# EAGLE schematic electrosteel2020_10_arrange4 (EAGLE 9.2.2), part 1 of 2
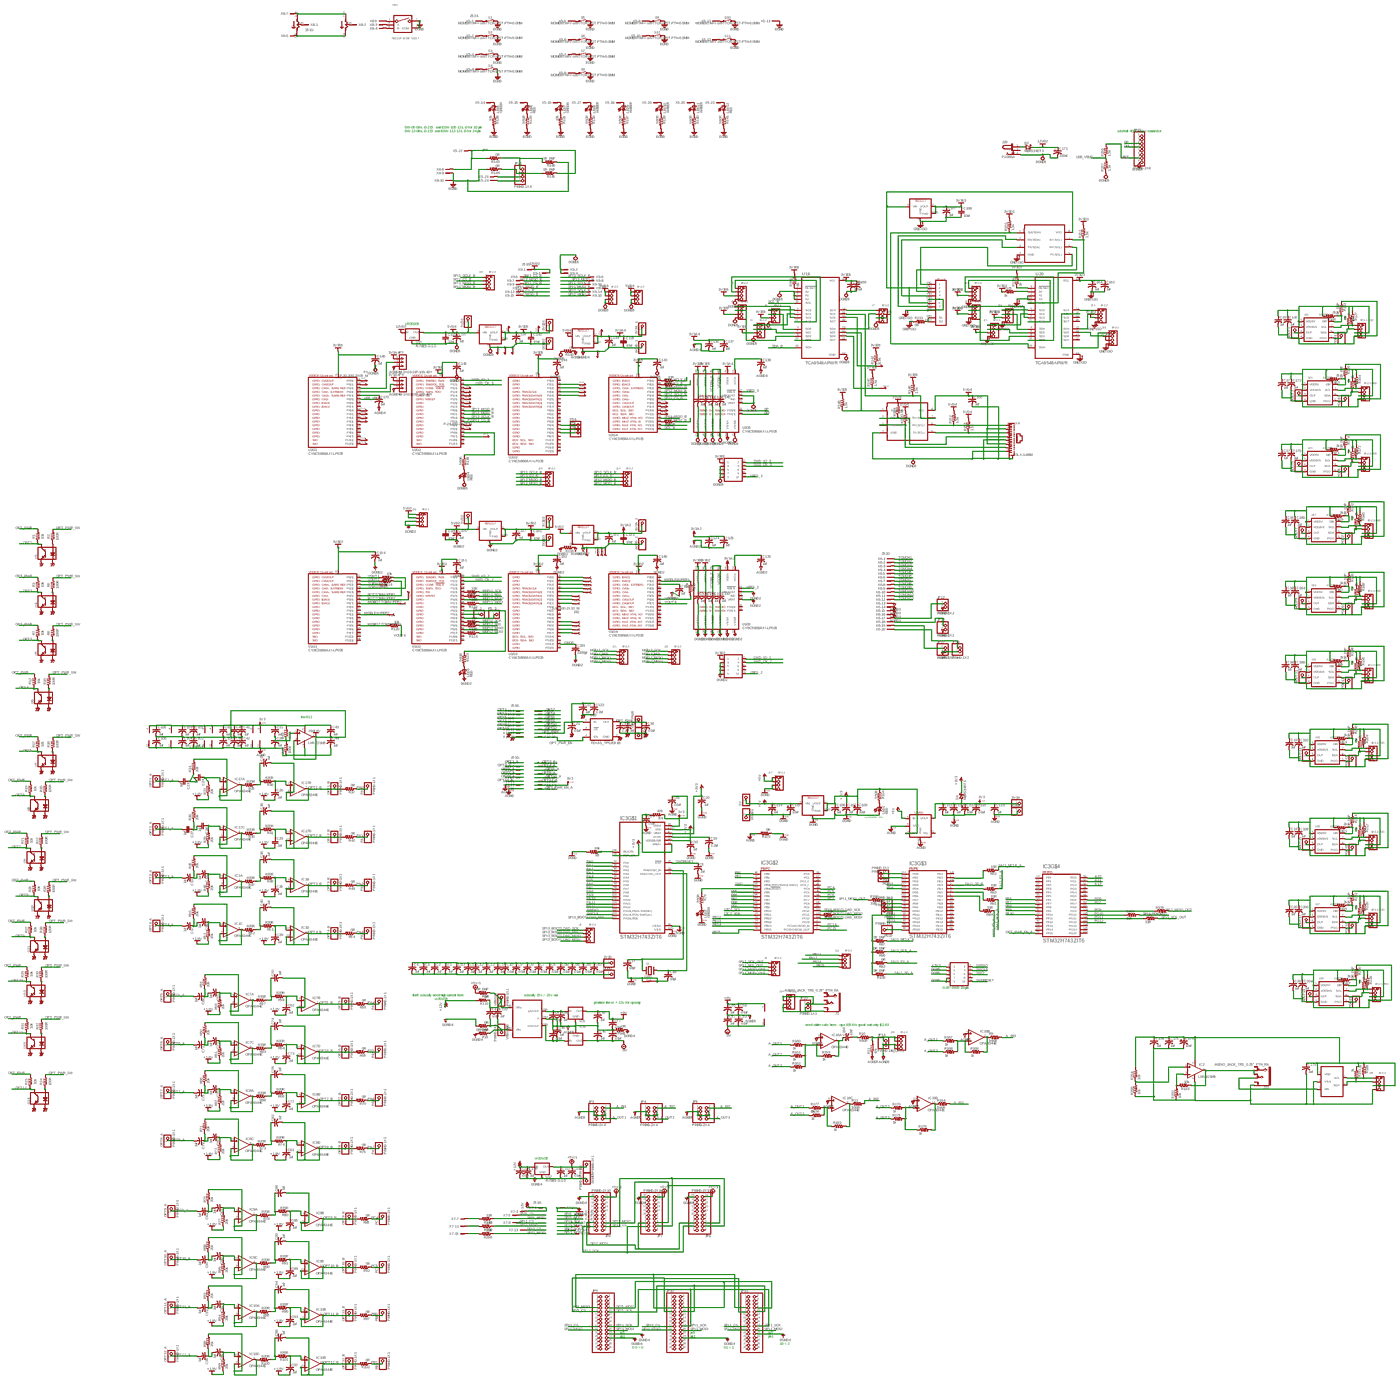
[diagram p0: schematic, sheet 1, overview]
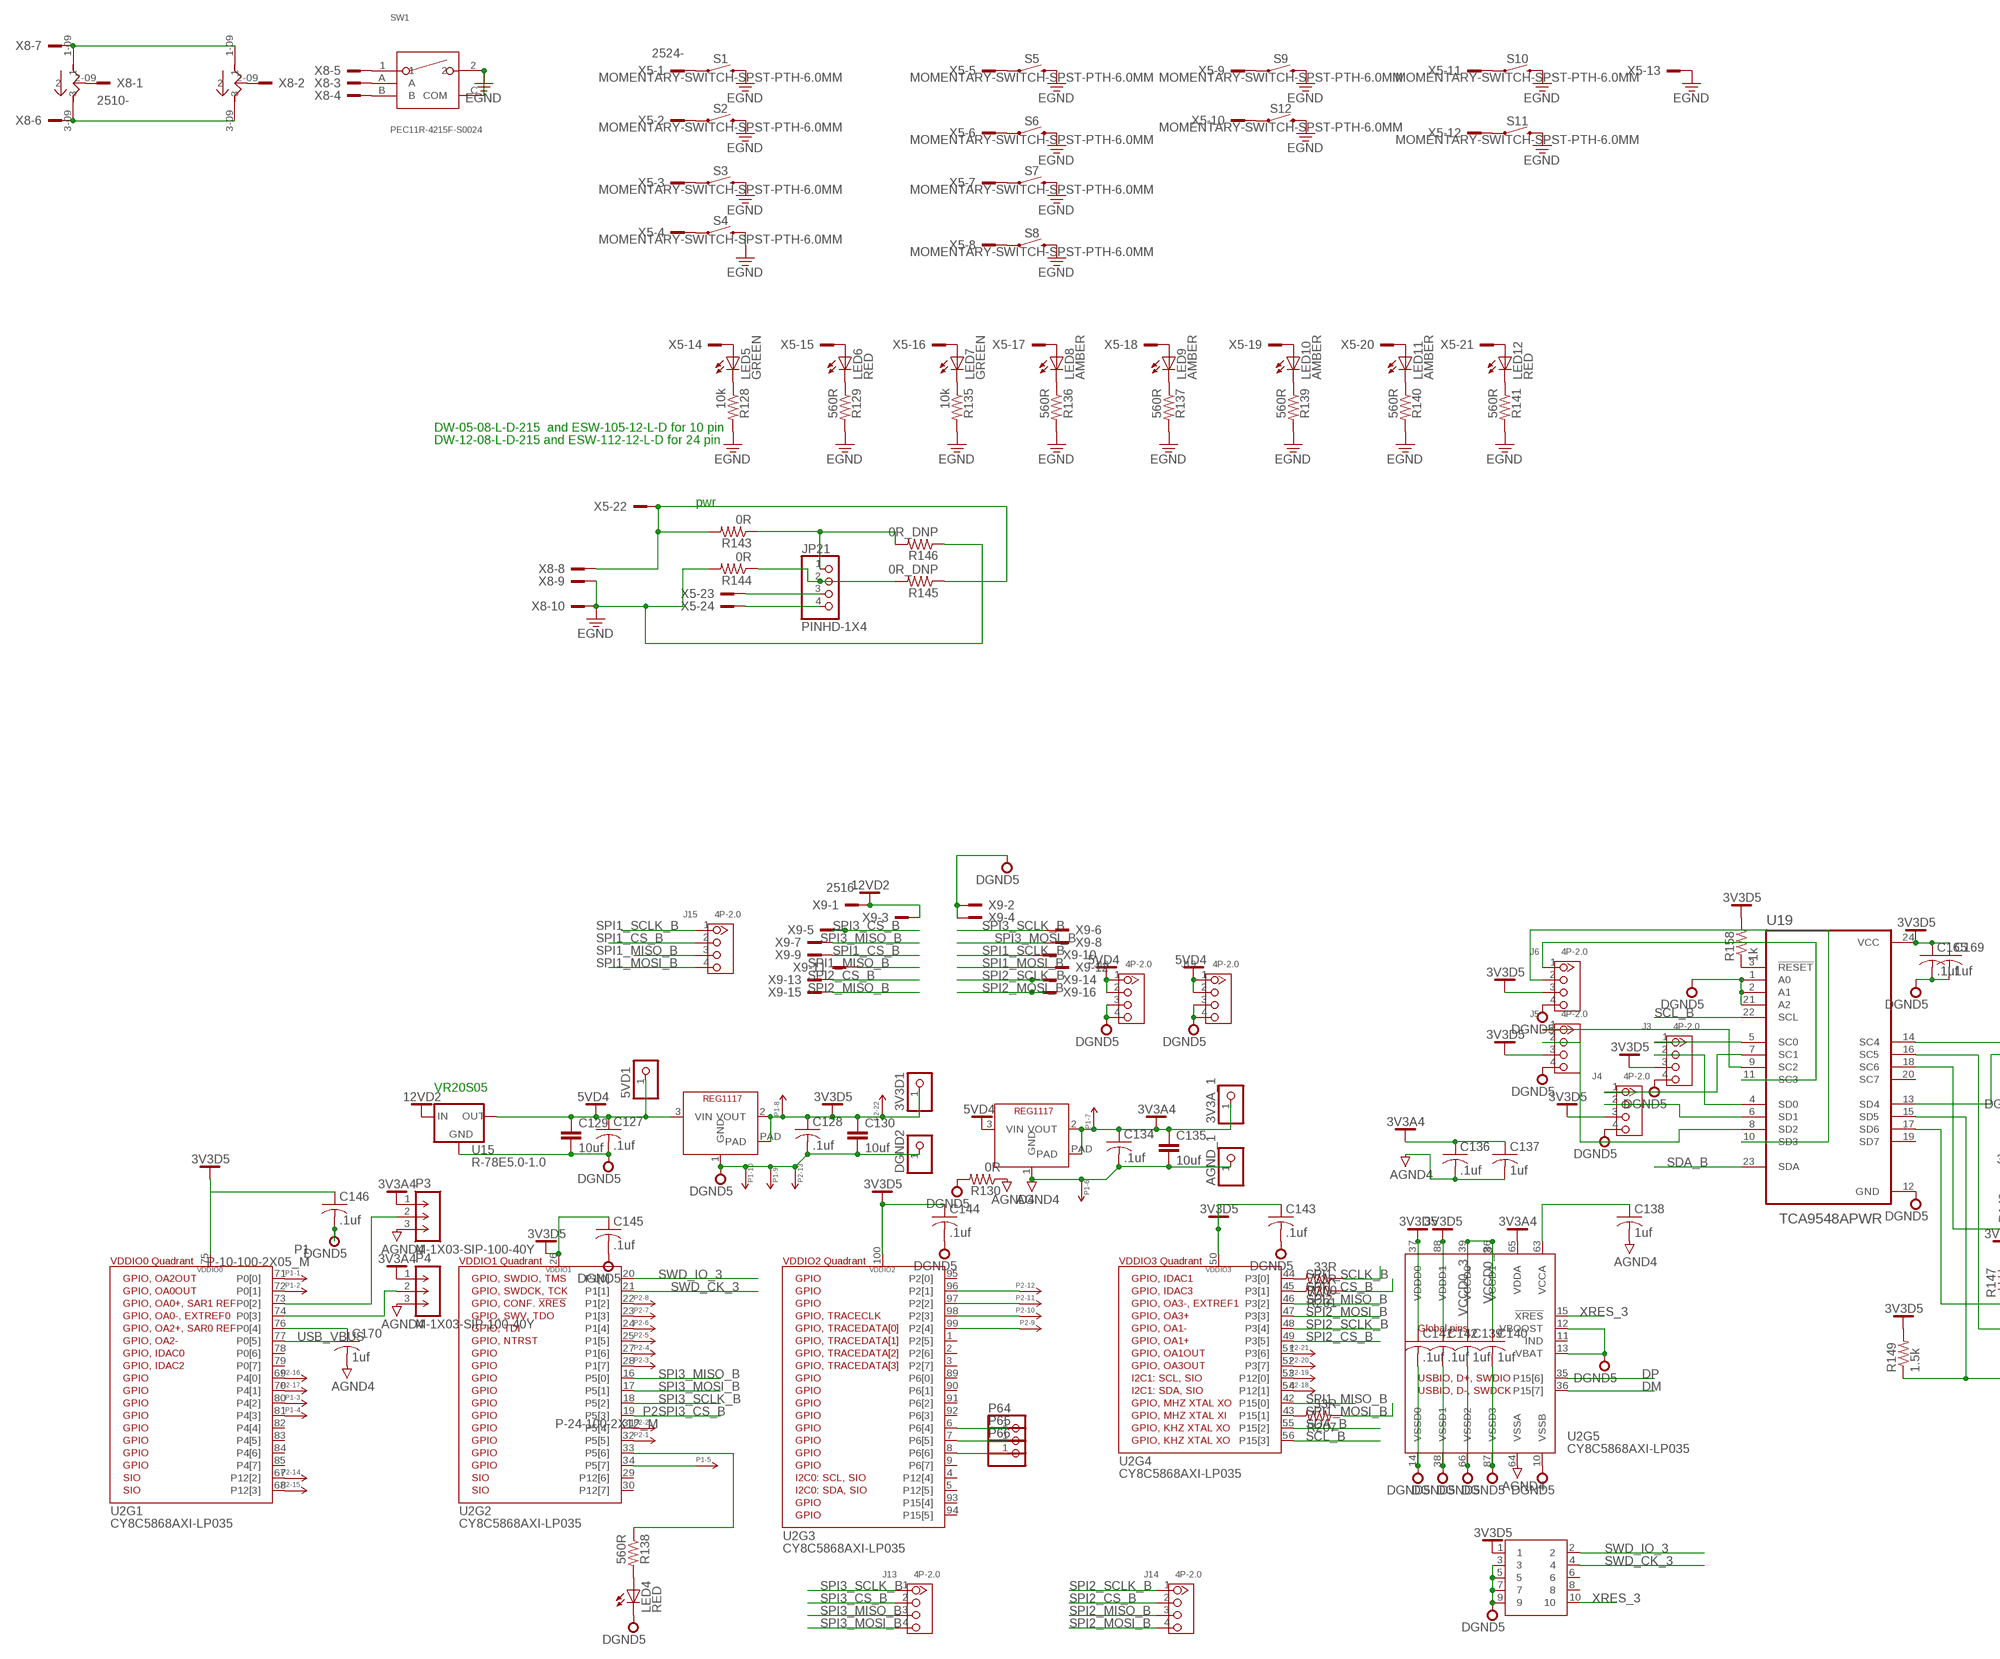
[diagram p1: schematic, sheet 1, part 1 of 6]
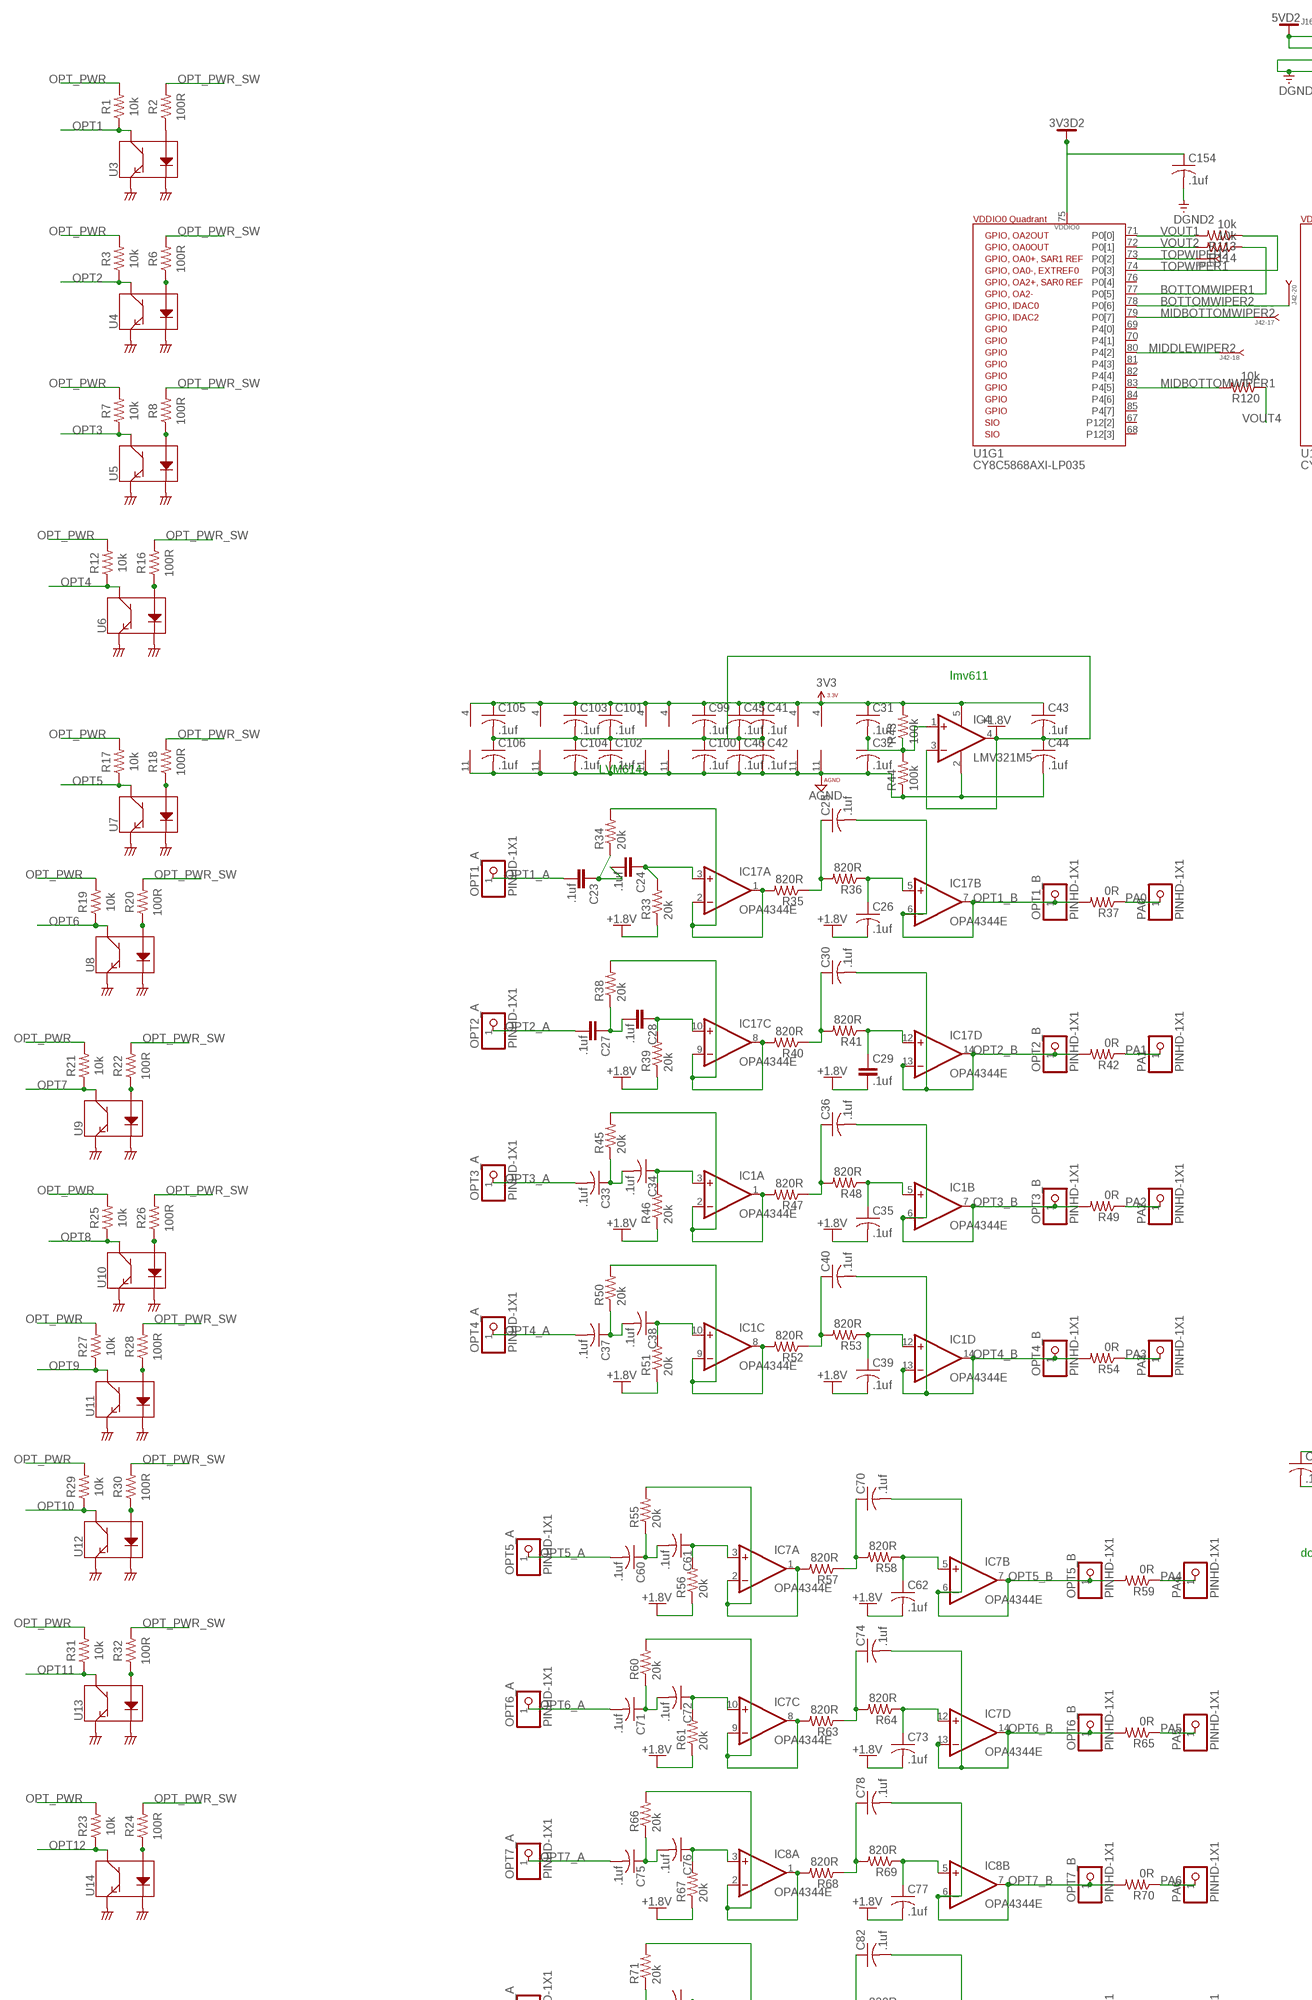
[diagram p2: schematic, sheet 1, part 2 of 6]
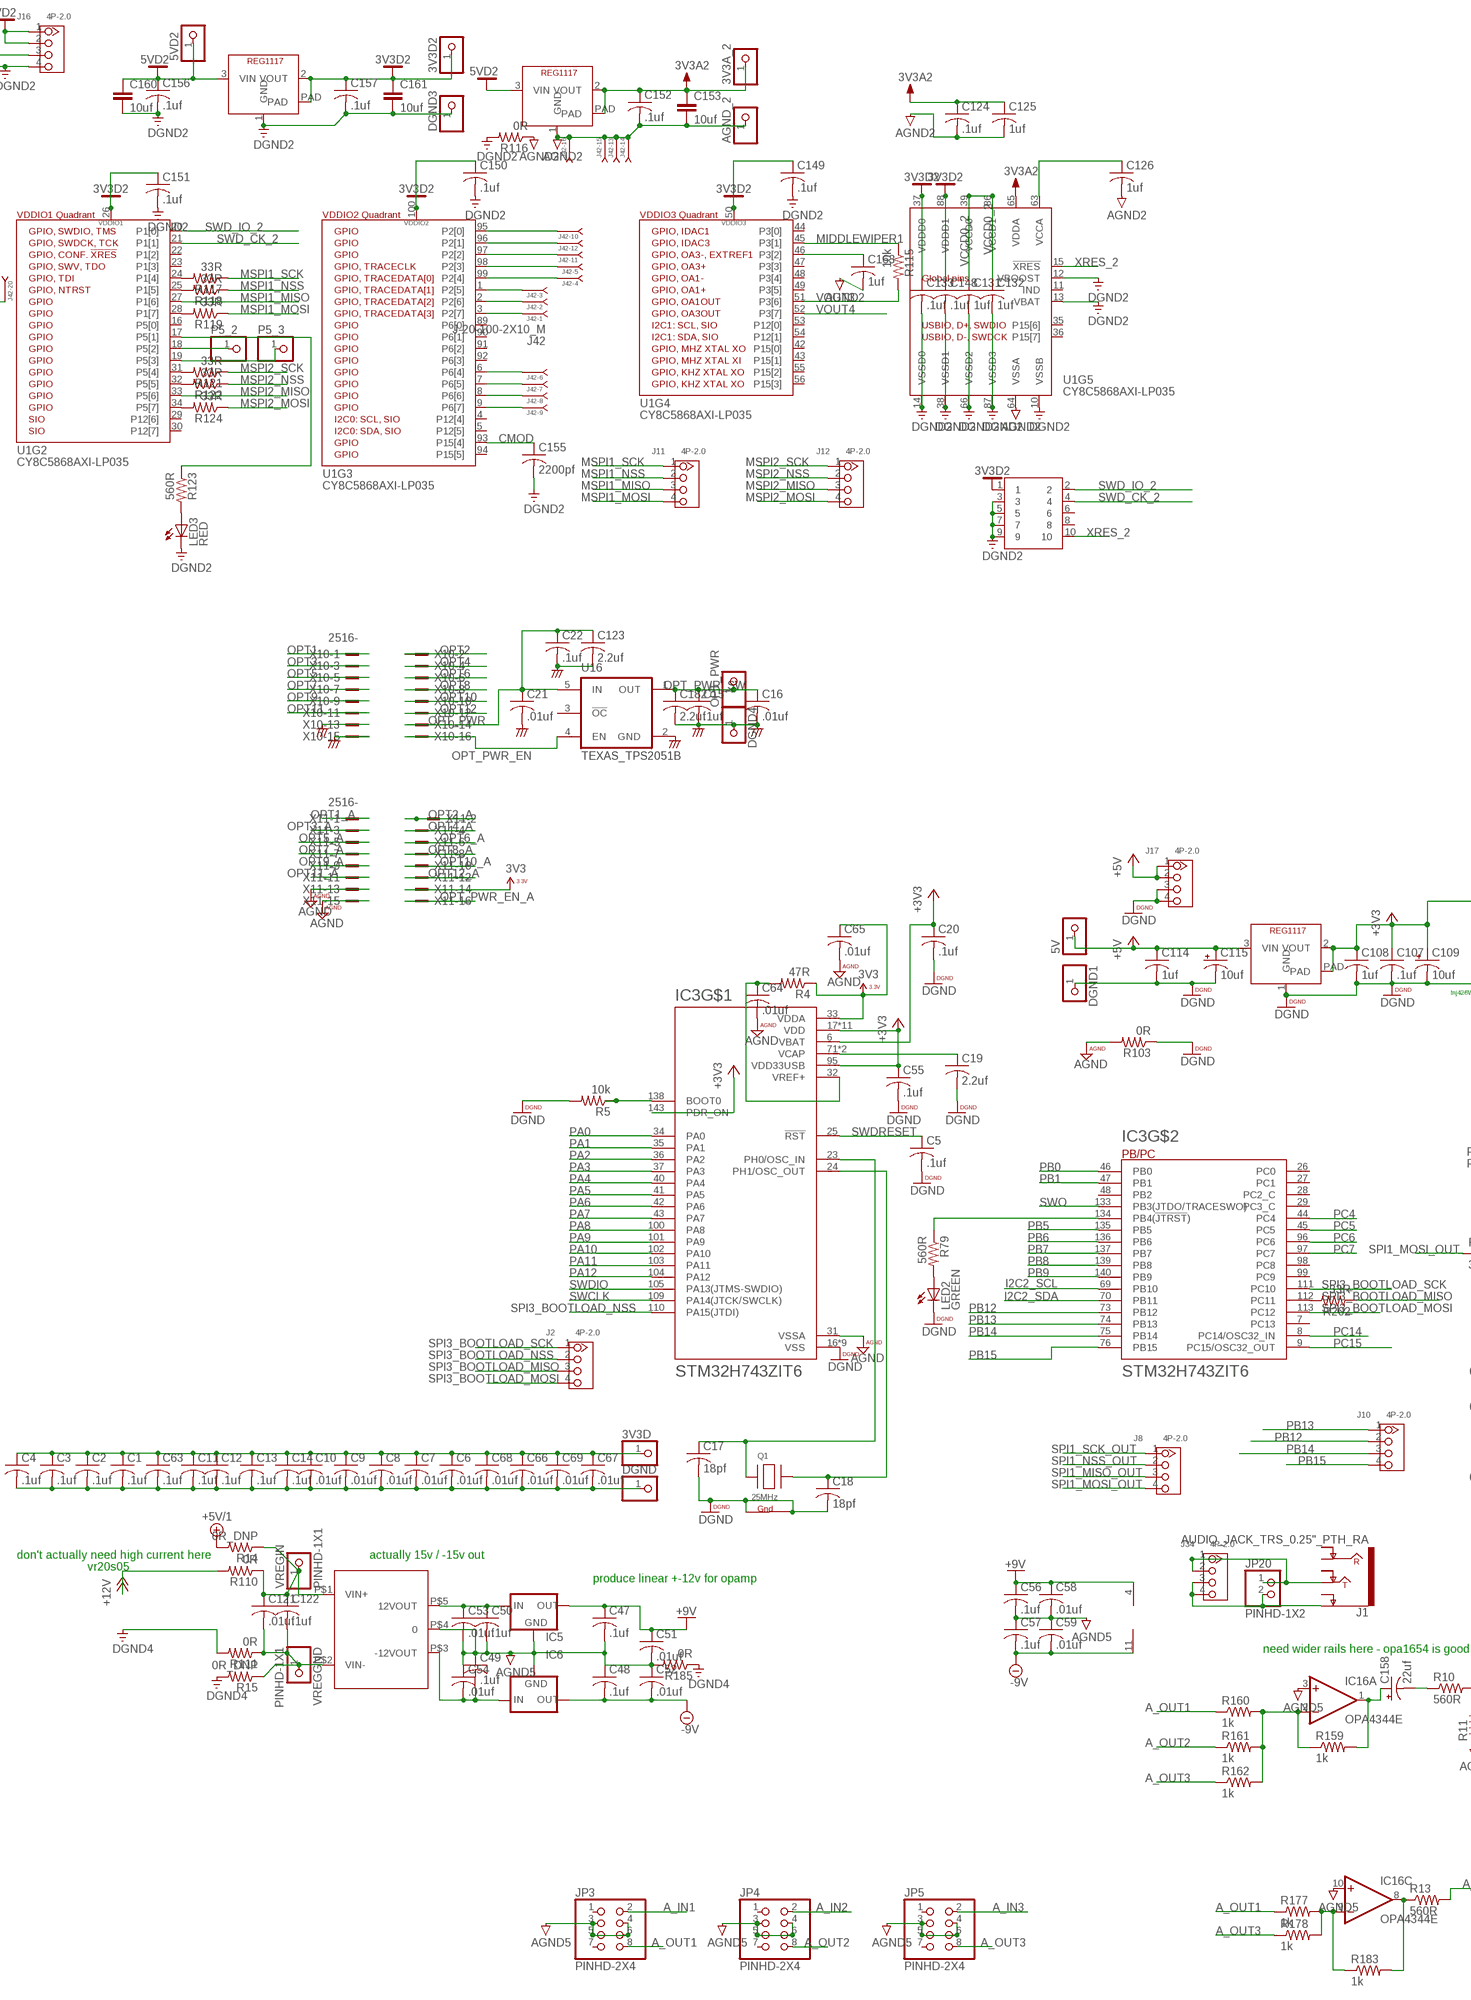
[diagram p3: schematic, sheet 1, part 3 of 6]
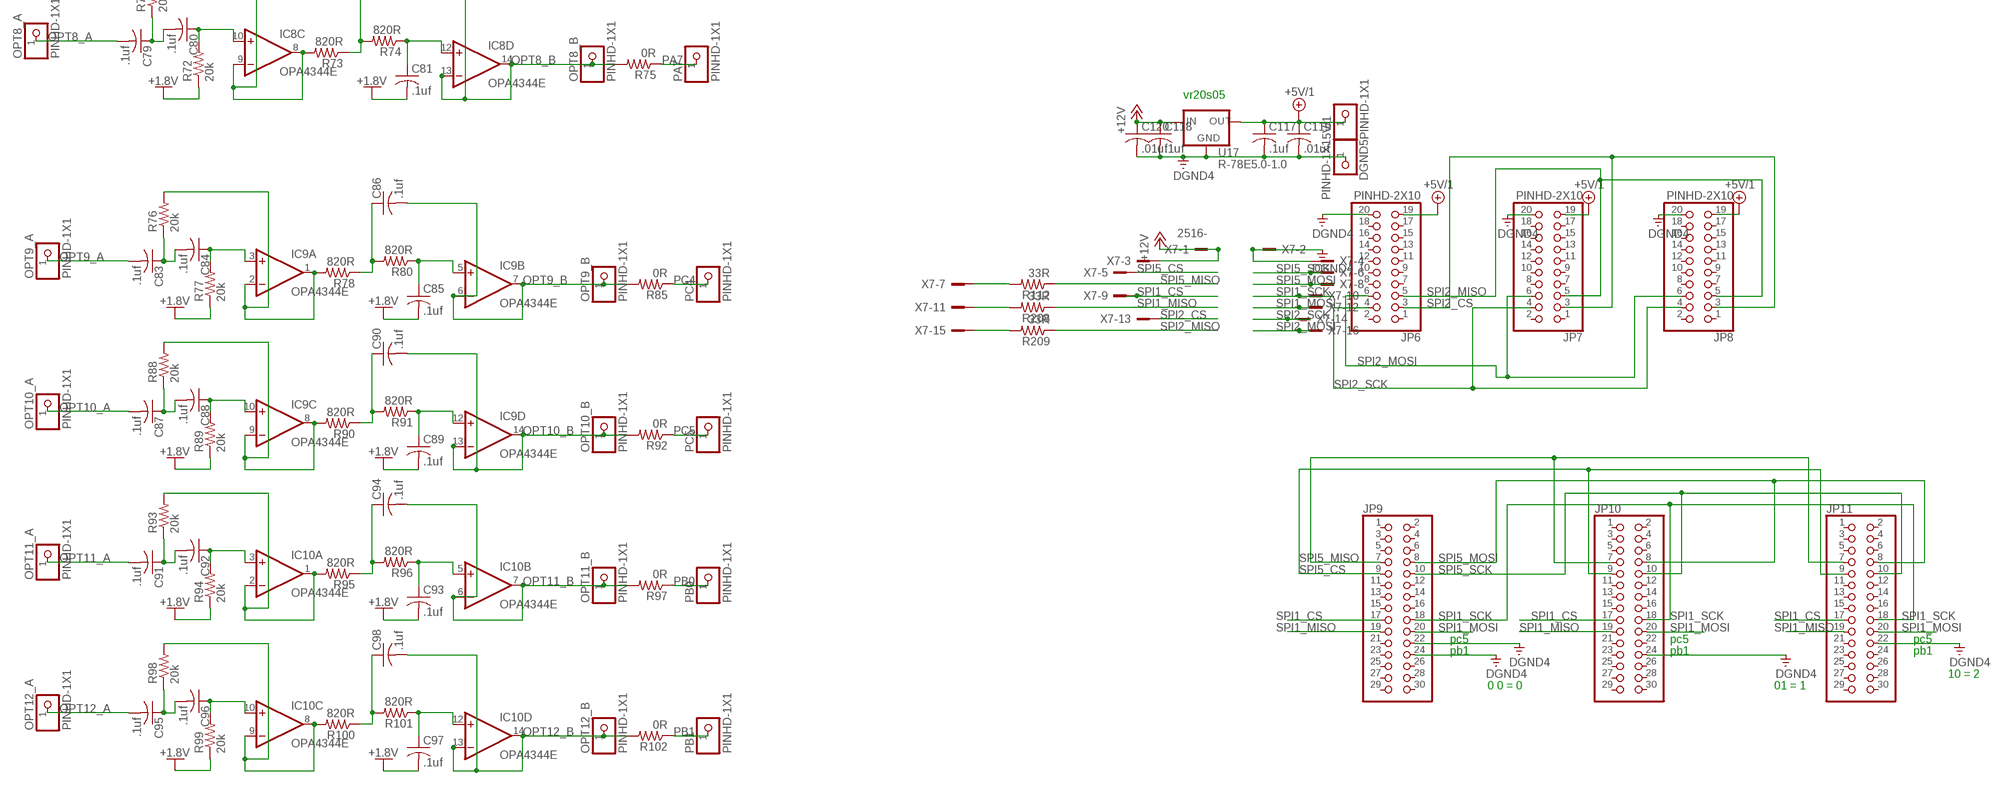
[diagram p4: schematic, sheet 1, part 4 of 6]
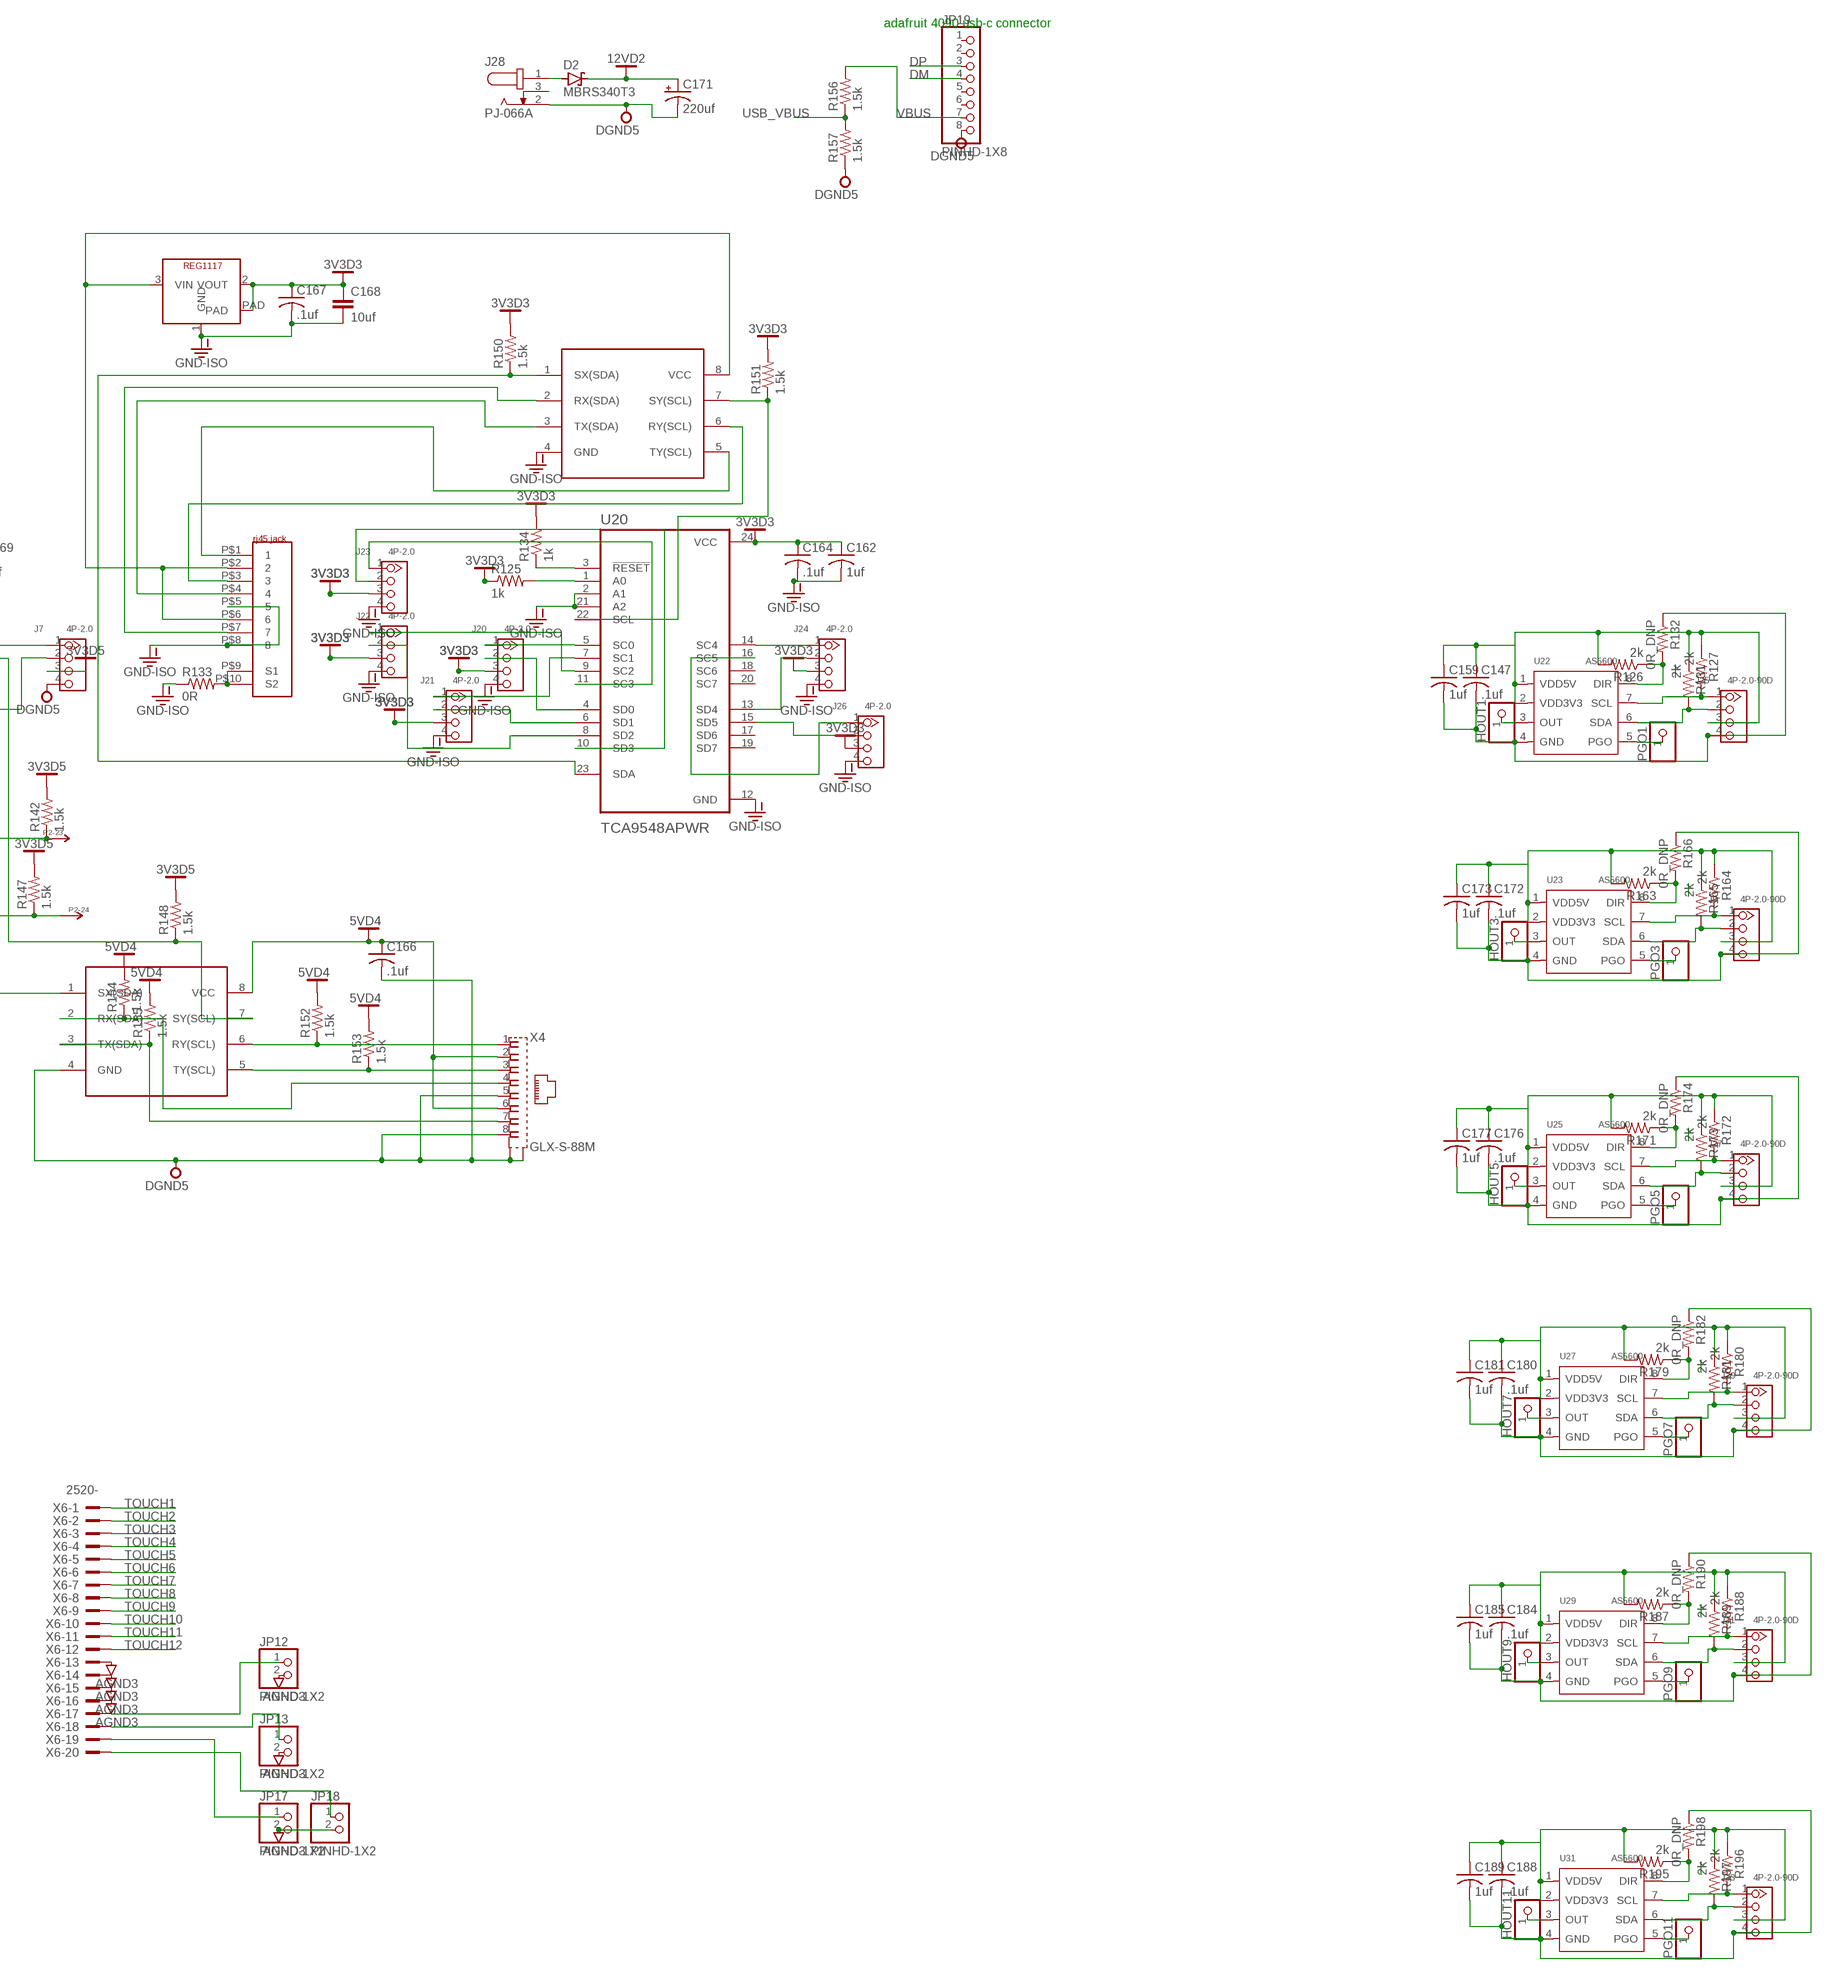
[diagram p5: schematic, sheet 1, part 5 of 6]
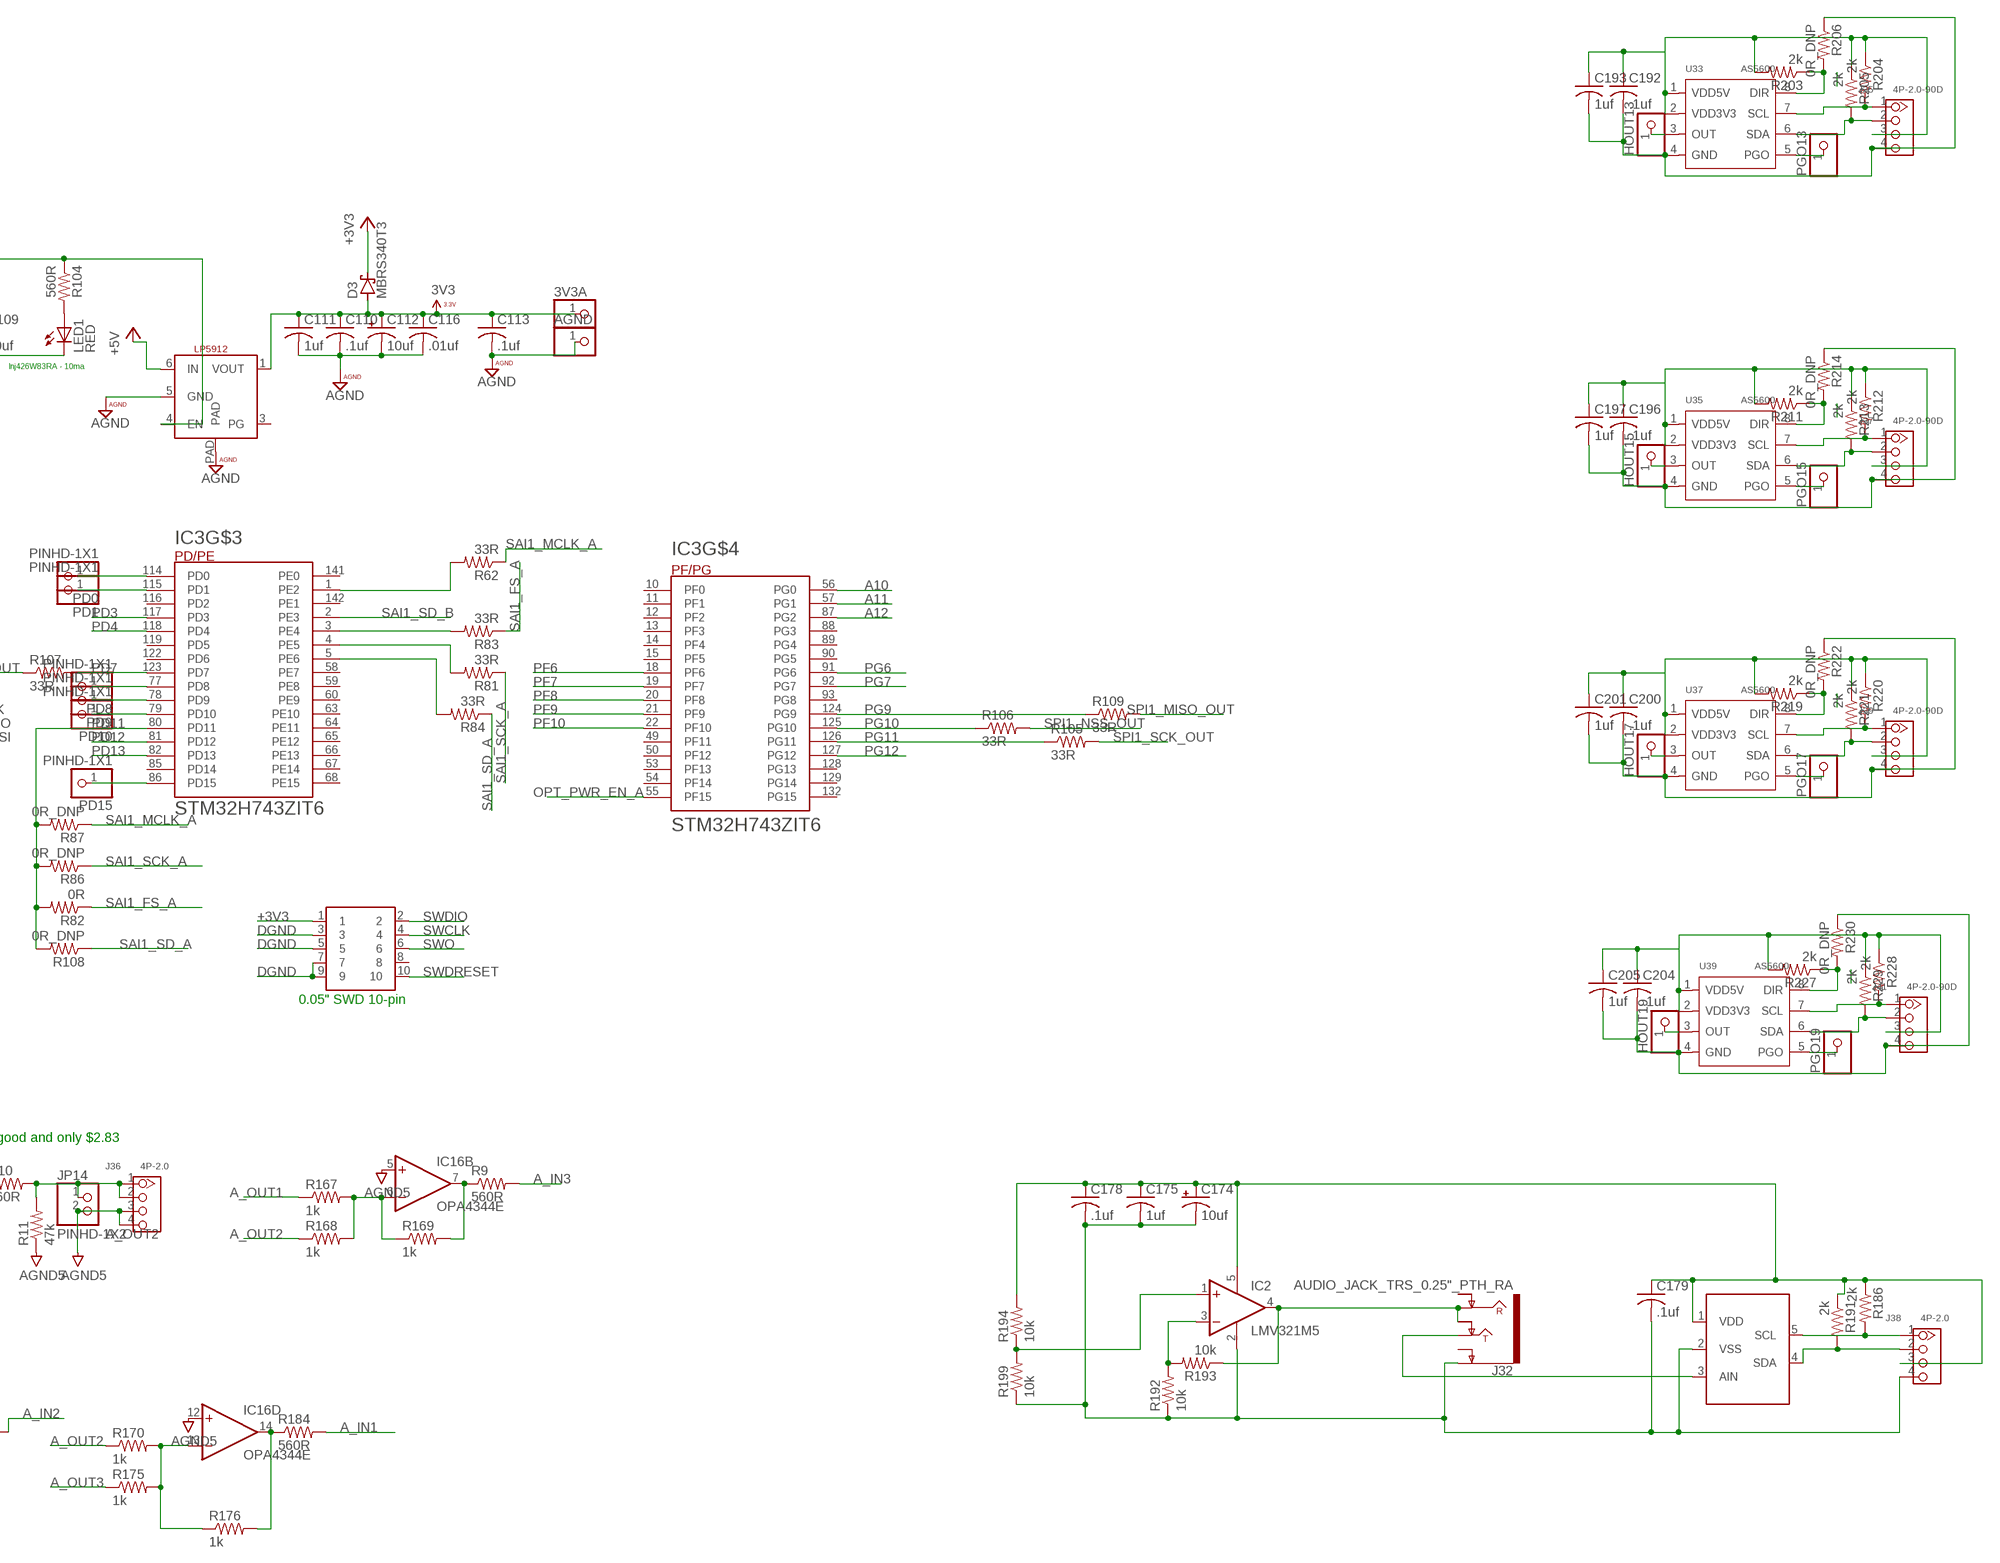
[diagram p6: schematic, sheet 1, part 6 of 6]

## Parts
3V3A  PINHD-1X1  [1X01]
3V3A_1  PINHD-1X1  [1X01]
3V3A_2  PINHD-1X1  [1X01]
3V3D  PINHD-1X1  [1X01]
3V3D1  PINHD-1X1  [1X01]
3V3D2  PINHD-1X1  [1X01]
5V  PINHD-1X1  [1X01]
5V/1  PINHD-1X1  [1X01]
5VD1  PINHD-1X1  [1X01]
5VD2  PINHD-1X1  [1X01]
AGND  PINHD-1X1  [1X01]
AGND_1  PINHD-1X1  [1X01]
AGND_2  PINHD-1X1  [1X01]
C1  .1uf  C-USC0402K  [C0402K]
C2  .1uf  C-USC0402K  [C0402K]
C3  .1uf  C-USC0402K  [C0402K]
C4  .1uf  C-USC0402K  [C0402K]
C5  .1uf  C-USC0402K  [C0402K]
C6  .01uf  C-USC0201  [C0201]
C7  .01uf  C-USC0201  [C0201]
C8  .01uf  C-USC0201  [C0201]
C9  .01uf  C-USC0201  [C0201]
C10  .01uf  C-USC0201  [C0201]
C11  .1uf  C-USC0402K  [C0402K]
C12  .1uf  C-USC0402K  [C0402K]
C13  .1uf  C-USC0402K  [C0402K]
C14  .1uf  C-USC0402  [C0402]
C15  .1uf  C-USC0402  [C0402]
C16  .01uf  C-USC0402  [C0402]
C17  18pf  C-USC0603  [C0603]
C18  18pf  C-USC0603  [C0603]
C19  2.2uf  C-USC1206  [C1206]
C20  .1uf  C-USC0402  [C0402]
C21  .01uf  C-USC0402  [C0402]
C22  .1uf  C-USC0402  [C0402]
C23  .1uf  CAP_0402  [0402]
C24  .1uf  CAP_0402  [0402]
C25  .1uf  C-USC0402  [C0402]
C26  .1uf  C-USC0402  [C0402]
C27  .1uf  CAP_0402  [0402]
C28  .1uf  CAP_0402  [0402]
C29  .1uf  CAP_0402  [0402]
C30  .1uf  C-USC0402  [C0402]
C31  .1uf  C-USC0402  [C0402]
C32  .1uf  C-USC0402  [C0402]
C33  .1uf  C-USC0402  [C0402]
C34  .1uf  C-USC0402  [C0402]
C35  .1uf  C-USC0402  [C0402]
C36  .1uf  C-USC0402  [C0402]
C37  .1uf  C-USC0402  [C0402]
C38  .1uf  C-USC0402  [C0402]
C39  .1uf  C-USC0402  [C0402]
C40  .1uf  C-USC0402  [C0402]
C41  .1uf  C-USC0402  [C0402]
C42  .1uf  C-USC0402  [C0402]
C43  .1uf  C-USC0402  [C0402]
C44  .1uf  C-USC0402  [C0402]
C45  .1uf  C-USC0402  [C0402]
C46  .1uf  C-USC0402  [C0402]
C47  .1uf  C-USC0402  [C0402]
C48  .1uf  C-USC0402  [C0402]
C49  .1uf  C-USC0402  [C0402]
C50  .1uf  C-USC0402  [C0402]
C51  .01uf  C-USC0201  [C0201]
C52  .01uf  C-USC0201  [C0201]
C53  .01uf  C-USC0201  [C0201]
C54  .01uf  C-USC0201  [C0201]
C55  .1uf  C-USC0402  [C0402]
C56  .1uf  C-USC0402  [C0402]
C57  .1uf  C-USC0402  [C0402]
C58  .01uf  C-USC0201  [C0201]
C59  .01uf  C-USC0201  [C0201]
C60  .1uf  C-USC0402  [C0402]
C61  .1uf  C-USC0402  [C0402]
C62  .1uf  C-USC0402  [C0402]
C63  .1uf  C-USC0402  [C0402]
C64  .01uf  C-USC0402  [C0402]
C65  .01uf  C-USC0402  [C0402]
C66  .01uf  C-USC0201  [C0201]
C67  .01uf  C-USC0201  [C0201]
C68  .01uf  C-USC0201  [C0201]
C69  .01uf  C-USC0201  [C0201]
C70  .1uf  C-USC0402  [C0402]
C71  .1uf  C-USC0402  [C0402]
C72  .1uf  C-USC0402  [C0402]
C73  .1uf  C-USC0402  [C0402]
C74  .1uf  C-USC0402  [C0402]
C75  .1uf  C-USC0402  [C0402]
C76  .1uf  C-USC0402  [C0402]
C77  .1uf  C-USC0402  [C0402]
C78  .1uf  C-USC0402  [C0402]
C79  .1uf  C-USC0402  [C0402]
C80  .1uf  C-USC0402  [C0402]
C81  .1uf  C-USC0402  [C0402]
C82  .1uf  C-USC0402  [C0402]
C83  .1uf  C-USC0402  [C0402]
C84  .1uf  C-USC0402  [C0402]
C85  .1uf  C-USC0402  [C0402]
C86  .1uf  C-USC0402  [C0402]
C87  .1uf  C-USC0402  [C0402]
C88  .1uf  C-USC0402  [C0402]
C89  .1uf  C-USC0402  [C0402]
C90  .1uf  C-USC0402  [C0402]
C91  .1uf  C-USC0402  [C0402]
C92  .1uf  C-USC0402  [C0402]
C93  .1uf  C-USC0402  [C0402]
C94  .1uf  C-USC0402  [C0402]
C95  .1uf  C-USC0402  [C0402]
C96  .1uf  C-USC0402  [C0402]
C97  .1uf  C-USC0402  [C0402]
C98  .1uf  C-USC0402  [C0402]
C99  .1uf  C-USC0402  [C0402]
C100  .1uf  C-USC0402  [C0402]
C101  .1uf  C-USC0402  [C0402]
C102  .1uf  C-USC0402  [C0402]
C103  .1uf  C-USC0402  [C0402]
C104  .1uf  C-USC0402  [C0402]
C105  .1uf  C-USC0402  [C0402]
C106  .1uf  C-USC0402  [C0402]
C107  .1uf  C-USC0603  [C0603]
C108  1uf  C-USC1206  [C1206]
C109  10uf  CPOL-USSMCB  [SMC_B]
C110  .1uf  C-USC0603  [C0603]
C111  1uf  C-USC1206  [C1206]
C112  10uf  CPOL-USSMCB  [SMC_B]
C113  .1uf  C-USC0402  [C0402]
C114  1uf  C-USC1206  [C1206]
C115  10uf  CPOL-USSMCB  [SMC_B]
C116  .01uf  C-USC0201  [C0201]
C117  .1uf  C-USC0402  [C0402]
C118  .1uf  C-USC0402  [C0402]
C119  .01uf  C-USC0201  [C0201]
C120  .01uf  C-USC0201  [C0201]
C121  .01uf  C-USC0201  [C0201]
C122  .1uf  C-USC0402  [C0402]
C123  2.2uf  C-USC1206  [C1206]
C124  .1uf  C-USC0603K  [C0603K]
C125  1uf  C-USC1206K  [C1206K]
C126  1uf  C-USC1206K  [C1206K]
C127  .1uf  C-USC0603K  [C0603K]
C128  .1uf  C-USC0603K  [C0603K]
C129  10uf  C-EUC1206K  [C1206K]
C130  10uf  C-EUC1206K  [C1206K]
C131  1uf  C-USC1206K  [C1206K]
C132  1uf  C-USC1206K  [C1206K]
C133  .1uf  C-USC0603K  [C0603K]
C134  .1uf  C-USC0603K  [C0603K]
C135  10uf  C-EUC1206K  [C1206K]
C136  .1uf  C-USC0603K  [C0603K]
C137  1uf  C-USC1206K  [C1206K]
C138  1uf  C-USC1206K  [C1206K]
C139  1uf  C-USC1206K  [C1206K]
C140  1uf  C-USC1206K  [C1206K]
C141  .1uf  C-USC0603K  [C0603K]
C142  .1uf  C-USC0603K  [C0603K]
C143  .1uf  C-USC0603K  [C0603K]
C144  .1uf  C-USC0603K  [C0603K]
C145  .1uf  C-USC0603K  [C0603K]
C146  .1uf  C-USC0603K  [C0603K]
C147  .1uf  C-USC0603K  [C0603K]
C148  .1uf  C-USC0603K  [C0603K]
C149  .1uf  C-USC0603K  [C0603K]
C150  .1uf  C-USC0603K  [C0603K]
C151  .1uf  C-USC0603K  [C0603K]
C152  .1uf  C-USC0603K  [C0603K]
C153  10uf  C-EUC1206K  [C1206K]
C154  .1uf  C-USC0603K  [C0603K]
C155  2200pf  C-USC0603K  [C0603K]
C156  .1uf  C-USC0603K  [C0603K]
C157  .1uf  C-USC0603K  [C0603K]
C158  22uf  CPOL-USD  [PANASONIC_D]
C159  1uf  C-USC1206K  [C1206K]
C160  10uf  C-EUC1206K  [C1206K]
C161  10uf  C-EUC1206K  [C1206K]
C162  1uf  C-USC1206K  [C1206K]
C163  1uf  C-USC1206K  [C1206K]
C164  .1uf  C-USC0603K  [C0603K]
C165  .1uf  C-USC0603K  [C0603K]
C166  .1uf  C-USC0603K  [C0603K]
C167  .1uf  C-USC0603K  [C0603K]
C168  10uf  C-EUC1206K  [C1206K]
C169  1uf  C-USC1206K  [C1206K]
C170  1uf  C-USC1206K  [C1206K]
C171  220uf  CPOL-USE5-10.5  [E5-10,5]
C172  .1uf  C-USC0603K  [C0603K]
C173  1uf  C-USC1206K  [C1206K]
C174  10uf  CPOL-USSMCB  [SMC_B]
C175  1uf  C-USC1206  [C1206]
C176  .1uf  C-USC0603K  [C0603K]
C177  1uf  C-USC1206K  [C1206K]
C178  .1uf  C-USC0603  [C0603]
C179  .1uf  C-USC0603  [C0603]
C180  .1uf  C-USC0603K  [C0603K]
C181  1uf  C-USC1206K  [C1206K]
C182  2.2uf  C-USC1206  [C1206]
C184  .1uf  C-USC0603K  [C0603K]
C185  1uf  C-USC1206K  [C1206K]
C188  .1uf  C-USC0603K  [C0603K]
C189  1uf  C-USC1206K  [C1206K]
C192  .1uf  C-USC0603K  [C0603K]
C193  1uf  C-USC1206K  [C1206K]
C196  .1uf  C-USC0603K  [C0603K]
C197  1uf  C-USC1206K  [C1206K]
C200  .1uf  C-USC0603K  [C0603K]
C201  1uf  C-USC1206K  [C1206K]
C204  .1uf  C-USC0603K  [C0603K]
C205  1uf  C-USC1206K  [C1206K]
D2  MBRS340T3  [SMC]
D3  MBRS340T3  [SMC]
DGND  PINHD-1X1  [1X01]
DGND1  PINHD-1X1  [1X01]
DGND2  PINHD-1X1  [1X01]
DGND3  PINHD-1X1  [1X01]
DGND4  PINHD-1X1  [1X01]
DGND5  PINHD-1X1  [1X01]
HOUT1  PINHD-1X1  [1X01]
HOUT3  PINHD-1X1  [1X01]
HOUT5  PINHD-1X1  [1X01]
HOUT7  PINHD-1X1  [1X01]
HOUT9  PINHD-1X1  [1X01]
HOUT11  PINHD-1X1  [1X01]
HOUT13  PINHD-1X1  [1X01]
HOUT15  PINHD-1X1  [1X01]
HOUT17  PINHD-1X1  [1X01]
HOUT19  PINHD-1X1  [1X01]
IC1  OPA4344E  [TSSOP14]
IC2  LMV321M5  [SOT23-5]
IC3  STM32H743ZIT6  [QFP50P2200X2200X160-144N]
IC4  LMV321M5  [SOT23-5]
IC5  78LXX  [78LXX]
IC6  79LXX  [79LXX]
IC7  OPA4344E  [TSSOP14]
IC8  OPA4344E  [TSSOP14]
IC9  OPA4344E  [TSSOP14]
IC10  OPA4344E  [TSSOP14]
IC11  LP5912  [6-WSON]
IC12  REG1117  [SOT223]
IC13  REG1117  [SOT223]
IC14  REG1117  [SOT223]
IC15  REG1117  [SOT223]
IC16  OPA4344E  [TSSOP14]
IC17  OPA4344E  [TSSOP14]
IC18  REG1117  [SOT223]
IC20  REG1117  [SOT223]
J1  AUDIO_JACK_TRS_0.25"_PTH_RA  [AUDIO_JACK_0.25"_TRS_PTH_RA]
J2  4P-2.0  GROVE-CONNECTOR-DIP(4P-2.0)  [HW4-2.0]
J3  4P-2.0  GROVE-CONNECTOR-DIP(4P-2.0)  [HW4-2.0]
J4  4P-2.0  GROVE-CONNECTOR-DIP(4P-2.0)  [HW4-2.0]
J5  4P-2.0  GROVE-CONNECTOR-DIP(4P-2.0)  [HW4-2.0]
J6  4P-2.0  GROVE-CONNECTOR-DIP(4P-2.0)  [HW4-2.0]
J7  4P-2.0  GROVE-CONNECTOR-DIP(4P-2.0)  [HW4-2.0]
J8  4P-2.0  GROVE-CONNECTOR-DIP(4P-2.0)  [HW4-2.0]
J9  4P-2.0-90D  GROVE-CONNECTOR-DIP-90D(4P-2.0)  [HW4-2.0-90D]
J10  4P-2.0  GROVE-CONNECTOR-DIP(4P-2.0)  [HW4-2.0]
J11  4P-2.0  GROVE-CONNECTOR-DIP(4P-2.0)  [HW4-2.0]
J12  4P-2.0  GROVE-CONNECTOR-DIP(4P-2.0)  [HW4-2.0]
J13  4P-2.0  GROVE-CONNECTOR-DIP(4P-2.0)  [HW4-2.0]
J14  4P-2.0  GROVE-CONNECTOR-DIP(4P-2.0)  [HW4-2.0]
J15  4P-2.0  GROVE-CONNECTOR-DIP(4P-2.0)  [HW4-2.0]
J16  4P-2.0  GROVE-CONNECTOR-DIP(4P-2.0)  [HW4-2.0]
J17  4P-2.0  GROVE-CONNECTOR-DIP(4P-2.0)  [HW4-2.0]
J18  4P-2.0  GROVE-CONNECTOR-DIP(4P-2.0)  [HW4-2.0]
J19  4P-2.0  GROVE-CONNECTOR-DIP(4P-2.0)  [HW4-2.0]
J20  4P-2.0  GROVE-CONNECTOR-DIP(4P-2.0)  [HW4-2.0]
J21  4P-2.0  GROVE-CONNECTOR-DIP(4P-2.0)  [HW4-2.0]
J22  4P-2.0  GROVE-CONNECTOR-DIP(4P-2.0)  [HW4-2.0]
J23  4P-2.0  GROVE-CONNECTOR-DIP(4P-2.0)  [HW4-2.0]
J24  4P-2.0  GROVE-CONNECTOR-DIP(4P-2.0)  [HW4-2.0]
J25  4P-2.0-90D  GROVE-CONNECTOR-DIP-90D(4P-2.0)  [HW4-2.0-90D]
J26  4P-2.0  GROVE-CONNECTOR-DIP(4P-2.0)  [HW4-2.0]
J27  4P-2.0-90D  GROVE-CONNECTOR-DIP-90D(4P-2.0)  [HW4-2.0-90D]
J28  PJ-066A  [CUI_PJ-066A]
J29  4P-2.0-90D  GROVE-CONNECTOR-DIP-90D(4P-2.0)  [HW4-2.0-90D]
J31  4P-2.0-90D  GROVE-CONNECTOR-DIP-90D(4P-2.0)  [HW4-2.0-90D]
J32  AUDIO_JACK_TRS_0.25"_PTH_RA  [AUDIO_JACK_0.25"_TRS_PTH_RA]
J33  4P-2.0-90D  GROVE-CONNECTOR-DIP-90D(4P-2.0)  [HW4-2.0-90D]
J34  4P-2.0  GROVE-CONNECTOR-DIP(4P-2.0)  [HW4-2.0]
J35  4P-2.0-90D  GROVE-CONNECTOR-DIP-90D(4P-2.0)  [HW4-2.0-90D]
J36  4P-2.0  GROVE-CONNECTOR-DIP(4P-2.0)  [HW4-2.0]
J37  4P-2.0-90D  GROVE-CONNECTOR-DIP-90D(4P-2.0)  [HW4-2.0-90D]
J38  4P-2.0  GROVE-CONNECTOR-DIP(4P-2.0)  [HW4-2.0]
J39  4P-2.0-90D  GROVE-CONNECTOR-DIP-90D(4P-2.0)  [HW4-2.0-90D]
J41  4P-2.0-90D  GROVE-CONNECTOR-DIP-90D(4P-2.0)  [HW4-2.0-90D]
J42  J-20-100-2X10_M  [DIL-100-2X10_M]
JP3  PINHD-2X4  [2X04]
JP4  PINHD-2X4  [2X04]
JP5  PINHD-2X4  [2X04]
JP6  PINHD-2X10  [2X10]
JP7  PINHD-2X10  [2X10]
JP8  PINHD-2X10  [2X10]
JP9  PINHD-2X15  [2X15]
JP10  PINHD-2X15  [2X15]
JP11  PINHD-2X15  [2X15]
JP12  PINHD-1X2  [1X02]
JP13  PINHD-1X2  [1X02]
JP14  PINHD-1X2  [1X02]
JP17  PINHD-1X2  [1X02]
JP18  PINHD-1X2  [1X02]
JP19  PINHD-1X8  [1X08]
JP20  PINHD-1X2  [1X02]
JP21  PINHD-1X4  [1X04]
LED1  RED  LEDCHIP-LED0603  [CHIP-LED0603]
LED2  GREEN  LEDCHIP-LED0603  [CHIP-LED0603]
LED3  RED  LEDCHIP-LED0603  [CHIP-LED0603]
LED4  RED  LEDCHIP-LED0603  [CHIP-LED0603]
LED5  GREEN  LEDP-LCC-2  [P-LCC-2]
LED6  RED  LEDP-LCC-2  [P-LCC-2]
LED7  GREEN  LEDP-LCC-2  [P-LCC-2]
LED8  AMBER  LEDP-LCC-2  [P-LCC-2]
LED9  AMBER  LEDP-LCC-2  [P-LCC-2]
LED10  AMBER  LEDP-LCC-2  [P-LCC-2]
LED11  AMBER  LEDP-LCC-2  [P-LCC-2]
LED12  RED  LEDP-LCC-2  [P-LCC-2]
OPT1_A  PINHD-1X1  [1X01]
OPT1_B  PINHD-1X1  [1X01]
OPT2_A  PINHD-1X1  [1X01]
OPT2_B  PINHD-1X1  [1X01]
OPT3_A  PINHD-1X1  [1X01]
OPT3_B  PINHD-1X1  [1X01]
OPT4_A  PINHD-1X1  [1X01]
OPT4_B  PINHD-1X1  [1X01]
OPT5_A  PINHD-1X1  [1X01]
OPT5_B  PINHD-1X1  [1X01]
OPT6_A  PINHD-1X1  [1X01]
OPT6_B  PINHD-1X1  [1X01]
OPT7_A  PINHD-1X1  [1X01]
OPT7_B  PINHD-1X1  [1X01]
OPT8_A  PINHD-1X1  [1X01]
OPT8_B  PINHD-1X1  [1X01]
OPT9_A  PINHD-1X1  [1X01]
OPT9_B  PINHD-1X1  [1X01]
OPT10_A  PINHD-1X1  [1X01]
OPT10_B  PINHD-1X1  [1X01]
OPT11_A  PINHD-1X1  [1X01]
OPT11_B  PINHD-1X1  [1X01]
OPT12_A  PINHD-1X1  [1X01]
OPT12_B  PINHD-1X1  [1X01]
OPT_PWR  PINHD-1X1  [1X01]
P1  P-10-100-2X05_M  [DIL-100-2X05_M]
P2  P-24-100-2X12_M  [DIL-100-2X12_M]
P3  M-1X03-SIP-100-40Y  [SIP-100-03-40Y]
P4  M-1X03-SIP-100-40Y  [SIP-100-03-40Y]
P5_2  PINHD-1X1  [1X01]
P5_3  PINHD-1X1  [1X01]
P64  PINHD-1X1  [1X01]
P65  PINHD-1X1  [1X01]
P66  PINHD-1X1  [1X01]
PA0  PINHD-1X1  [1X01]
PA1  PINHD-1X1  [1X01]
PA2  PINHD-1X1  [1X01]
PA3  PINHD-1X1  [1X01]
PA4  PINHD-1X1  [1X01]
PA5  PINHD-1X1  [1X01]
PA6  PINHD-1X1  [1X01]
PA7  PINHD-1X1  [1X01]
PB0  PINHD-1X1  [1X01]
PB1  PINHD-1X1  [1X01]
PC4  PINHD-1X1  [1X01]
PC5  PINHD-1X1  [1X01]
PD0  PINHD-1X1  [1X01]
PD1  PINHD-1X1  [1X01]
PD8  PINHD-1X1  [1X01]
PD9  PINHD-1X1  [1X01]
PD10  PINHD-1X1  [1X01]
PD15  PINHD-1X1  [1X01]
PGO1  PINHD-1X1  [1X01]
PGO3  PINHD-1X1  [1X01]
PGO5  PINHD-1X1  [1X01]
PGO7  PINHD-1X1  [1X01]
PGO9  PINHD-1X1  [1X01]
PGO11  PINHD-1X1  [1X01]
PGO13  PINHD-1X1  [1X01]
PGO15  PINHD-1X1  [1X01]
PGO17  PINHD-1X1  [1X01]
PGO19  PINHD-1X1  [1X01]
Q1  25MHz  XTAL-4-3225  [NX3225]
R1  10k  R-US_CHIP-0603(1608-METRIC)  [RESC1608X60]
R2  100R  R-US_CHIP-0603(1608-METRIC)  [RESC1608X60]
R3  10k  R-US_CHIP-0603(1608-METRIC)  [RESC1608X60]
R4  47R  R-US_R0603  [R0603]
R5  10k  R-US_R0603  [R0603]
R6  100R  R-US_CHIP-0603(1608-METRIC)  [RESC1608X60]
R7  10k  R-US_CHIP-0603(1608-METRIC)  [RESC1608X60]
R8  100R  R-US_CHIP-0603(1608-METRIC)  [RESC1608X60]
R9  560R  R-US_R0603  [R0603]
R10  560R  R-US_R0603  [R0603]
R11  47k  R-US_R0603  [R0603]
R12  10k  R-US_CHIP-0603(1608-METRIC)  [RESC1608X60]
R13  560R  R-US_R0603  [R0603]
R14  0R_DNP  R-US_R0603  [R0603]
R15  0R_DNP  R-US_R0603  [R0603]
R16  100R  R-US_CHIP-0603(1608-METRIC)  [RESC1608X60]
R17  10k  R-US_CHIP-0603(1608-METRIC)  [RESC1608X60]
R18  100R  R-US_CHIP-0603(1608-METRIC)  [RESC1608X60]
R19  10k  R-US_CHIP-0603(1608-METRIC)  [RESC1608X60]
R20  100R  R-US_CHIP-0603(1608-METRIC)  [RESC1608X60]
R21  10k  R-US_CHIP-0603(1608-METRIC)  [RESC1608X60]
R22  100R  R-US_CHIP-0603(1608-METRIC)  [RESC1608X60]
R23  10k  R-US_CHIP-0603(1608-METRIC)  [RESC1608X60]
R24  100R  R-US_CHIP-0603(1608-METRIC)  [RESC1608X60]
R25  10k  R-US_CHIP-0603(1608-METRIC)  [RESC1608X60]
R26  100R  R-US_CHIP-0603(1608-METRIC)  [RESC1608X60]
R27  10k  R-US_CHIP-0603(1608-METRIC)  [RESC1608X60]
R28  100R  R-US_CHIP-0603(1608-METRIC)  [RESC1608X60]
R29  10k  R-US_CHIP-0603(1608-METRIC)  [RESC1608X60]
R30  100R  R-US_CHIP-0603(1608-METRIC)  [RESC1608X60]
R31  10k  R-US_CHIP-0603(1608-METRIC)  [RESC1608X60]
R32  100R  R-US_CHIP-0603(1608-METRIC)  [RESC1608X60]
R33  20k  R-US_R0603  [R0603]
R34  20k  R-US_R0603  [R0603]
R35  820R  R-US_R0603  [R0603]
R36  820R  R-US_R0603  [R0603]
R37  0R  R-US_R0603  [R0603]
R38  20k  R-US_R0603  [R0603]
R39  20k  R-US_R0603  [R0603]
R40  820R  R-US_R0603  [R0603]
R41  820R  R-US_R0603  [R0603]
R42  0R  R-US_R0603  [R0603]
R43  100k  R-US_R0603  [R0603]
R44  100k  R-US_R0603  [R0603]
R45  20k  R-US_R0603  [R0603]
R46  20k  R-US_R0603  [R0603]
R47  820R  R-US_R0603  [R0603]
R48  820R  R-US_R0603  [R0603]
R49  0R  R-US_R0603  [R0603]
R50  20k  R-US_R0603  [R0603]
R51  20k  R-US_R0603  [R0603]
R52  820R  R-US_R0603  [R0603]
R53  820R  R-US_R0603  [R0603]
R54  0R  R-US_R0603  [R0603]
R55  20k  R-US_R0603  [R0603]
R56  20k  R-US_R0603  [R0603]
R57  820R  R-US_R0603  [R0603]
R58  820R  R-US_R0603  [R0603]
R59  0R  R-US_R0603  [R0603]
R60  20k  R-US_R0603  [R0603]
R61  20k  R-US_R0603  [R0603]
R62  33R  R-US_R0201  [R0201]
R63  820R  R-US_R0603  [R0603]
R64  820R  R-US_R0603  [R0603]
R65  0R  R-US_R0603  [R0603]
R66  20k  R-US_R0603  [R0603]
R67  20k  R-US_R0603  [R0603]
R68  820R  R-US_R0603  [R0603]
R69  820R  R-US_R0603  [R0603]
R70  0R  R-US_R0603  [R0603]
R71  20k  R-US_R0603  [R0603]
R72  20k  R-US_R0603  [R0603]
R73  820R  R-US_R0603  [R0603]
R74  820R  R-US_R0603  [R0603]
R75  0R  R-US_R0603  [R0603]
R76  20k  R-US_R0603  [R0603]
R77  20k  R-US_R0603  [R0603]
R78  820R  R-US_R0603  [R0603]
R79  560R  R-US_R0603  [R0603]
R80  820R  R-US_R0603  [R0603]
R81  33R  R-US_R0201  [R0201]
R82  0R  R-US_R0603  [R0603]
R83  33R  R-US_R0201  [R0201]
R84  33R  R-US_R0201  [R0201]
R85  0R  R-US_R0603  [R0603]
R86  0R_DNP  R-US_R0603  [R0603]
R87  0R_DNP  R-US_R0603  [R0603]
R88  20k  R-US_R0603  [R0603]
R89  20k  R-US_R0603  [R0603]
R90  820R  R-US_R0603  [R0603]
R91  820R  R-US_R0603  [R0603]
R92  0R  R-US_R0603  [R0603]
R93  20k  R-US_R0603  [R0603]
R94  20k  R-US_R0603  [R0603]
R95  820R  R-US_R0603  [R0603]
R96  820R  R-US_R0603  [R0603]
R97  0R  R-US_R0603  [R0603]
R98  20k  R-US_R0603  [R0603]
R99  20k  R-US_R0603  [R0603]
R100  820R  R-US_R0603  [R0603]
R101  820R  R-US_R0603  [R0603]
R102  0R  R-US_R0603  [R0603]
R103  0R  R-US_R0603  [R0603]
R104  560R  R-US_R0603  [R0603]
R105  33R  R-US_R0402  [R0402]
R106  33R  R-US_R0402  [R0402]
R107  33R  R-US_R0402  [R0402]
R108  0R_DNP  R-US_R0603  [R0603]
R109  33R  R-US_R0402  [R0402]
R110  0R  R-US_R0603  [R0603]
R111  0R  R-US_R0603  [R0603]
R112  33R  R-US_R0201  [R0201]
R113  10k  R-US_R0603  [R0603]
R114  10k  R-US_R0603  [R0603]
R115  10k  R-US_R0603  [R0603]
R116  0R  R-US_R0603  [R0603]
R117  33R  R-US_R0201  [R0201]
R118  33R  R-US_R0201  [R0201]
R119  33R  R-US_R0201  [R0201]
R120  10k  R-US_R0603  [R0603]
R121  33R  R-US_R0201  [R0201]
R122  33R  R-US_R0201  [R0201]
R123  560R  R-US_R0603  [R0603]
R124  33R  R-US_R0201  [R0201]
R125  1k  R-US_R0603  [R0603]
R126  2k  R-US_R0603  [R0603]
R127  2k  R-US_R0603  [R0603]
R128  10k  R-US_R0603  [R0603]
R129  560R  R-US_R0603  [R0603]
R130  0R  R-US_R0603  [R0603]
R131  2k  R-US_R0603  [R0603]
R132  0R_DNP  R-US_R0603  [R0603]
R133  0R  R-US_R0603  [R0603]
R134  1k  R-US_R0603  [R0603]
R135  10k  R-US_R0603  [R0603]
R136  560R  R-US_R0603  [R0603]
R137  560R  R-US_R0603  [R0603]
R138  560R  R-US_R0603  [R0603]
R139  560R  R-US_R0603  [R0603]
R140  560R  R-US_R0603  [R0603]
R141  560R  R-US_R0603  [R0603]
R142  1.5k  R-US_R0603  [R0603]
R143  0R  R-US_R0603  [R0603]
R144  0R  R-US_R0603  [R0603]
R145  0R_DNP  R-US_R0603  [R0603]
R146  0R_DNP  R-US_R0603  [R0603]
R147  1.5k  R-US_R0603  [R0603]
R148  1.5k  R-US_R0603  [R0603]
R149  1.5k  R-US_R0603  [R0603]
R150  1.5k  R-US_R0603  [R0603]
R151  1.5k  R-US_R0603  [R0603]
R152  1.5k  R-US_R0603  [R0603]
R153  1.5k  R-US_R0603  [R0603]
R154  1.5k  R-US_R0603  [R0603]
R155  1.5k  R-US_R0603  [R0603]
R156  1.5k  R-US_R0603  [R0603]
R157  1.5k  R-US_R0603  [R0603]
R158  1k  R-US_R0603  [R0603]
R159  1k  R-US_R0603  [R0603]
R160  1k  R-US_R0603  [R0603]
R161  1k  R-US_R0603  [R0603]
R162  1k  R-US_R0603  [R0603]
R163  2k  R-US_R0603  [R0603]
R164  2k  R-US_R0603  [R0603]
R165  2k  R-US_R0603  [R0603]
R166  0R_DNP  R-US_R0603  [R0603]
R167  1k  R-US_R0603  [R0603]
R168  1k  R-US_R0603  [R0603]
R169  1k  R-US_R0603  [R0603]
R170  1k  R-US_R0603  [R0603]
R171  2k  R-US_R0603  [R0603]
R172  2k  R-US_R0603  [R0603]
R173  2k  R-US_R0603  [R0603]
R174  0R_DNP  R-US_R0603  [R0603]
R175  1k  R-US_R0603  [R0603]
R176  1k  R-US_R0603  [R0603]
R177  1k  R-US_R0603  [R0603]
R178  1k  R-US_R0603  [R0603]
R179  2k  R-US_R0603  [R0603]
R180  2k  R-US_R0603  [R0603]
R181  2k  R-US_R0603  [R0603]
R182  0R_DNP  R-US_R0603  [R0603]
R183  1k  R-US_R0603  [R0603]
R184  560R  R-US_R0603  [R0603]
R185  0R  R-US_R0603  [R0603]
R186  2k  R-US_R0603  [R0603]
R187  2k  R-US_R0603  [R0603]
R188  2k  R-US_R0603  [R0603]
R189  2k  R-US_R0603  [R0603]
R190  0R_DNP  R-US_R0603  [R0603]
R191  2k  R-US_R0603  [R0603]
R192  10k  R-US_R0603  [R0603]
R193  10k  R-US_R0603  [R0603]
R194  10k  R-US_R0603  [R0603]
R195  2k  R-US_R0603  [R0603]
R196  2k  R-US_R0603  [R0603]
R197  2k  R-US_R0603  [R0603]
R198  0R_DNP  R-US_R0603  [R0603]
R199  10k  R-US_R0603  [R0603]
R200  33R  R-US_R0201  [R0201]
R201  33R  R-US_R0201  [R0201]
R202  33R  R-US_R0201  [R0201]
R203  2k  R-US_R0603  [R0603]
R204  2k  R-US_R0603  [R0603]
R205  2k  R-US_R0603  [R0603]
R206  0R_DNP  R-US_R0603  [R0603]
R207  33R  R-US_R0201  [R0201]
R208  33R  R-US_R0201  [R0201]
R209  33R  R-US_R0201  [R0201]
R211  2k  R-US_R0603  [R0603]
R212  2k  R-US_R0603  [R0603]
R213  2k  R-US_R0603  [R0603]
R214  0R_DNP  R-US_R0603  [R0603]
R219  2k  R-US_R0603  [R0603]
R220  2k  R-US_R0603  [R0603]
R221  2k  R-US_R0603  [R0603]
R222  0R_DNP  R-US_R0603  [R0603]
R227  2k  R-US_R0603  [R0603]
R228  2k  R-US_R0603  [R0603]
R229  2k  R-US_R0603  [R0603]
R230  0R_DNP  R-US_R0603  [R0603]
S1  MOMENTARY-SWITCH-SPST-PTH-6.0MM  [TACTILE_SWITCH_PTH_6.0MM]
S2  MOMENTARY-SWITCH-SPST-PTH-6.0MM  [TACTILE_SWITCH_PTH_6.0MM]
S3  MOMENTARY-SWITCH-SPST-PTH-6.0MM  [TACTILE_SWITCH_PTH_6.0MM]
S4  MOMENTARY-SWITCH-SPST-PTH-6.0MM  [TACTILE_SWITCH_PTH_6.0MM]
S5  MOMENTARY-SWITCH-SPST-PTH-6.0MM  [TACTILE_SWITCH_PTH_6.0MM]
S6  MOMENTARY-SWITCH-SPST-PTH-6.0MM  [TACTILE_SWITCH_PTH_6.0MM]
S7  MOMENTARY-SWITCH-SPST-PTH-6.0MM  [TACTILE_SWITCH_PTH_6.0MM]
S8  MOMENTARY-SWITCH-SPST-PTH-6.0MM  [TACTILE_SWITCH_PTH_6.0MM]
S9  MOMENTARY-SWITCH-SPST-PTH-6.0MM  [TACTILE_SWITCH_PTH_6.0MM]
S10  MOMENTARY-SWITCH-SPST-PTH-6.0MM  [TACTILE_SWITCH_PTH_6.0MM]
S11  MOMENTARY-SWITCH-SPST-PTH-6.0MM  [TACTILE_SWITCH_PTH_6.0MM]
S12  MOMENTARY-SWITCH-SPST-PTH-6.0MM  [TACTILE_SWITCH_PTH_6.0MM]
SW1  PEC11R-4215F-S0024  [PEC11R-4215F-S0024]
U1  CY8C5868AXI-LP035  PSOC_5LP_100QFP  [TQFP-100-14X14MM]
U2  CY8C5868AXI-LP035  PSOC_5LP_100QFP  [TQFP-100-14X14MM]
U3  QRE1113  [QRE1113]
U4  QRE1113  [QRE1113]
U5  QRE1113  [QRE1113]
U6  QRE1113  [QRE1113]
U7  QRE1113  [QRE1113]
U8  QRE1113  [QRE1113]
U9  QRE1113  [QRE1113]
U10  QRE1113  [QRE1113]
U11  QRE1113  [QRE1113]
U12  QRE1113  [QRE1113]
U13  QRE1113  [QRE1113]
U14  QRE1113  [QRE1113]
U15  R-78E5.0-1.0  [DC-DC_CONVERTER_78XX]
U16  TEXAS_TPS2051B  [TEXAS_SOT23-5]
U17  R-78E5.0-1.0  [DC-DC_CONVERTER_78XX]
U19  TCA9548APWR  [SOP65P640X120-24N]
U20  TCA9548APWR  [SOP65P640X120-24N]
U22  AS5600  SENSOR-AS5600  [SOIC8-1.27-5X4MM]
U23  AS5600  SENSOR-AS5600  [SOIC8-1.27-5X4MM]
U25  AS5600  SENSOR-AS5600  [SOIC8-1.27-5X4MM]
U27  AS5600  SENSOR-AS5600  [SOIC8-1.27-5X4MM]
U29  AS5600  SENSOR-AS5600  [SOIC8-1.27-5X4MM]
U31  AS5600  SENSOR-AS5600  [SOIC8-1.27-5X4MM]
U33  AS5600  SENSOR-AS5600  [SOIC8-1.27-5X4MM]
U35  AS5600  SENSOR-AS5600  [SOIC8-1.27-5X4MM]
U37  AS5600  SENSOR-AS5600  [SOIC8-1.27-5X4MM]
U39  AS5600  SENSOR-AS5600  [SOIC8-1.27-5X4MM]
U$1  RK09  [RK09]
U$2  RK09  [RK09]
U$3  CMR0512S3C  [CMR0512S3C]
U$5  MCP3221  [SOT23-5L]
U$6  SS-7188VS-A-FLS  [SS-7188VS-A-FLS_RJ45]
U$9  P82B96DP,118  [SO8]
U$10  P82B96DP,118  [SO8]
VREGGND  PINHD-1X1  [1X01]
VREGIN  PINHD-1X1  [1X01]
X1  3221-10-0300-00  [3221-10-0300-00]
X2  3221-10-0300-00  [3221-10-0300-00]
X3  3221-10-0300-00  [3221-10-0300-00]
X4  GLX-S-88M  [GLX-S-88M]
X5  2524-  [PAK100/2500-24]
X6  2520-  [PAK100/2500-20]
X7  2516-  [PAK100/2500-16]
X8  2510-  [PAK100/2500-10]
X9  2516-  [PAK100/2500-16]
X10  2516-  [PAK100/2500-16]
X11  2516-  [PAK100/2500-16]

## Nets
3V3: C31.1 C41.1 C43.1 C45.1 C99.1 C101.1 C103.1 C105.1 IC1.4(P:V+) IC4.5(V+) IC7.4(P:V+) IC8.4(P:V+) IC9.4(P:V+) IC10.4(P:V+) IC17.4(P:V+) R43.2 X11.14
3V3A: 3V3A.1 C65.1 C110.1 C111.1 C112.+ C113.1 C116.1 D3.A IC3.33(VDDA) IC11.1(VOUT) R4.1 ; supply symbol labelled 3V3
3V3A2: 3V3A_2.1 C124.1 C125.1 C152.1 C153.1 IC18.2(VOUT) IC18.PAD U1.65(VDDA)
3V3A4: 3V3A_1.1 C134.1 C135.1 C136.1 C137.1 IC14.2(VOUT) IC14.PAD P1.7 P3.1 P4.1 U2.65(VDDA)
3V3D2: 3V3D2.1 C133.1 C148.1 C149.1 C150.1 C151.1 C154.1 C157.1 C161.1 IC20.2(VOUT) IC20.PAD U1.26(VDDIO1) U1.37(VDDD0) U1.50(VDDIO3) U1.75(VDDIO0) U1.88(VDDD1) U1.100(VDDIO2) X3.1
3V3D3: C162.1 C164.1 C167.1 C168.1 IC15.2(VOUT) IC15.PAD J20.3 J21.3 J22.3 J23.3 J24.3 J26.3 R125.1 R134.2 R150.2 R151.2 U20.24(VCC)
3V3D5: 3V3D1.1 C128.1 C130.1 C141.1 C142.1 C143.1 C144.1 C145.1 C146.1 C165.1 C169.1 IC13.2(VOUT) IC13.PAD J3.3 J4.3 J5.3 J6.3 J7.3 P1.8 P2.22 R142.2 R147.2 R148.2 R149.2 R158.2 U2.26(VDDIO1) U2.37(VDDD0) U2.50(VDDIO3) U2.75(VDDIO0) U2.88(VDDD1) U2.100(VDDIO2) U19.24(VCC) X1.1
5VD2: 5VD2.1 C156.1 C160.1 IC18.3(VIN) IC20.3(VIN) J16.1 J16.2
5VD4: 5VD1.1 C127.1 C129.1 C166.1 IC13.3(VIN) IC14.3(VIN) J18.1 J18.2 J19.1 J19.2 R152.2 R153.2 R154.2 R155.2 U15.VOUT(OUT) U$9.8(VCC) X4.2 X4.6
12VD2: C171.+ D2.C U15.VIN(IN) X9.1 X9.3
+1.8V: C26.2 C29.2 C35.2 C39.2 C41.2 C42.1 C43.2 C44.1 C45.2 C46.1 C62.2 C73.2 C77.2 C81.2 C85.2 C89.2 C93.2 C97.2 C99.2 C100.1 C101.2 C102.1 C103.2 C104.1 C105.2 C106.1 IC4.3(-IN) IC4.4(OUT) R33.1 R39.1 R46.1 R51.1 R56.1 R61.1 R67.1 R72.1 R77.1 R89.1 R94.1 R99.1
+3V3: 3V3D.1 C1.1 C2.1 C3.1 C4.1 C6.1 C7.1 C8.1 C9.1 C10.1 C11.1 C12.1 C13.1 C14.1 C20.1 C55.1 C63.1 C66.1 C67.1 C68.1 C69.1 C107.1 C108.1 C109.+ D3.C IC3.6(VBAT) IC3.17(VDD) IC3.30(VDD) IC3.39(VDD) IC3.52(VDD) IC3.62(VDD) IC3.72(VDD) IC3.84(VDD) IC3.95(VDD33USB) IC3.108(VDD) IC3.121(VDD) IC3.131(VDD) IC3.143(PDR_ON) IC3.144(VDD) IC11.4(EN) IC12.2(VOUT) IC12.PAD R104.1 X2.1
+5V: 5V.1 C114.1 C115.+ IC11.6(IN) IC12.3(VIN) J17.1 J17.2
+5V/1: 5V/1.1 C117.1 C119.1 JP6.19 JP7.19 JP8.19 R14.2 U17.VOUT(OUT)
+9V: C47.1 C51.1 C56.1 C58.1 IC5.OUT IC16.4(P:V+)
+12V: C118.1 C120.1 R110.2 U17.VIN(IN) X7.1 X7.3
-9V: C48.2 C52.2 C57.2 C59.2 IC6.OUT IC16.11(P:V-)
A10: IC3.56(PG0)
A11: IC3.57(PG1)
A12: IC3.87(PG2)
A_IN1: JP3.2 R184.2
A_IN2: JP4.2 R13.2
A_IN3: JP5.2 R9.2
A_OUT1: JP3.8 R160.1 R167.1 R177.1
A_OUT2: JP4.8 R161.1 R168.1 R170.1
A_OUT3: JP5.8 R162.1 R175.1 R178.1
AGND: AGND.1 C32.2 C42.2 C44.2 C46.2 C64.2 C65.2 C100.2 C102.2 C104.2 C106.2 C110.2 C111.2 C112.- C113.2 C116.2 IC1.11(P:V-) IC3.31(VSSA) IC4.2(V-) IC7.11(P:V-) IC8.11(P:V-) IC9.11(P:V-) IC10.11(P:V-) IC11.5(GND) IC11.PAD IC17.11(P:V-) R44.1 R103.2 X11.13 X11.15
AGND2: AGND_2.1 C124.2 C125.2 C126.2 C152.2 C153.2 C163.2 IC18.1(GND) J42.13 J42.14 J42.15 J42.16 R116.1 U1.64(VSSA)
AGND3: JP12.2 JP13.2 JP17.2 JP18.2 X6.13 X6.14 X6.15 X6.16
AGND4: AGND_1.1 C134.2 C135.2 C136.2 C137.2 C138.2 C170.2 IC14.1(GND) P1.6 P3.3 P4.3 R130.1 U2.64(VSSA)
AGND5: C47.2 C48.1 C49.1 C50.2 C51.2 C52.1 C53.2 C54.1 C56.2 C57.1 C58.2 C59.1 IC5.GND IC6.GND IC16.3(A:+IN) IC16.5(B:+IN) IC16.10(C:+IN) IC16.12(D:+IN) J36.3 J36.4 JP3.3 JP3.4 JP3.5 JP3.6 JP4.3 JP4.4 JP4.5 JP4.6 JP5.3 JP5.4 JP5.5 JP5.6 JP14.2 R11.1 R185.2 U$3.P$4
BOTTOMWIPER1: R114.1 U1.77(P0[5])
BOTTOMWIPER2: J42.20 U1.78(P0[6])
CGND: C15.2 C16.2 C21.2 C22.2 C123.2 C182.2 DGND4.1 U3.2(K) U3.4(E) U4.2(K) U4.4(E) U5.2(K) U5.4(E) U6.2(K) U6.4(E) U7.2(K) U7.4(E) U8.2(K) U8.4(E) U9.2(K) U9.4(E) U10.2(K) U10.4(E) U11.2(K) U11.4(E) U12.2(K) U12.4(E) U13.2(K) U13.4(E) U14.2(K) U14.4(E) U16.2(GND) X10.13 X10.15 ; supply symbol labelled SUPPLY0_CGND_
CMOD: C155.1 U1.93(P15[4])
DGND: C1.2 C2.2 C3.2 C4.2 C5.2 C6.2 C7.2 C8.2 C9.2 C10.2 C11.2 C12.2 C13.2 C14.2 C17.2 C18.2 C19.2 C20.2 C55.2 C63.2 C66.2 C67.2 C68.2 C69.2 C107.2 C108.2 C109.- C114.2 C115.- DGND1.1 DGND.1 IC3.16(VSS) IC3.38(VSS) IC3.51(VSS) IC3.61(VSS) IC3.83(VSS) IC3.94(VSS) IC3.107(VSS) IC3.120(VSS) IC3.130(VSS) IC12.1(GND) J17.3 J17.4 LED1.C LED2.C Q1.2(G2) Q1.4(G1) R5.2 R103.1 X2.3 X2.5 X2.7 X2.9
DGND2: C131.2 C132.2 C133.2 C148.2 C149.2 C150.2 C151.2 C154.2 C155.2 C156.2 C157.2 C160.2 C161.2 DGND3.1 IC20.1(GND) J16.3 J16.4 LED3.C R116.2 U1.10(VSSB) U1.12(VBOOST) U1.13(VBAT) U1.14(VSSD0) U1.38(VSSD1) U1.66(VSSD2) U1.87(VSSD3) X3.3 X3.5 X3.7 X3.9
DGND4: C117.2 C118.2 C119.2 C120.2 DGND5.1 JP6.20 JP7.20 JP8.20 JP9.22 JP9.24 JP10.24 JP11.22 R15.2 R111.2 R185.1 U17.GND X7.2 X7.4
DGND5: C127.2 C128.2 C129.2 C130.2 C139.2 C140.2 C141.2 C142.2 C143.2 C144.2 C145.2 C146.2 C165.2 C166.2 C169.2 C171.- DGND2.1 IC13.1(GND) J3.4 J4.4 J5.4 J6.4 J7.4 J18.3 J18.4 J19.3 J19.4 J28.2 JP19.8 LED4.C P1.9 P1.10 P2.13 R130.2 R157.1 U2.10(VSSB) U2.12(VBOOST) U2.13(VBAT) U2.14(VSSD0) U2.38(VSSD1) U2.66(VSSD2) U2.87(VSSD3) U15.GND U19.1(A0) U19.2(A1) U19.12(GND) U19.21(A2) U$9.4(GND) X1.3 X1.5 X1.7 X1.9 X4.5 X4.8 X4.S1 X4.S2 X9.2 X9.4
DM: JP19.4 U2.36(P15[7])
DP: JP19.3 U2.35(P15[6])
EGND: R128.2 R129.2 R135.2 R136.2 R137.2 R139.2 R140.2 R141.2 R144.2 R146.1 S1.3 S2.3 S3.3 S4.3 S5.3 S6.3 S7.3 S8.3 S9.3 S10.3 S11.3 S12.3 SW1.2 SW1.C(COM) X5.13 X8.9 X8.10
GND-ISO: C162.2 C164.2 C167.2 C168.2 IC15.1(GND) J20.4 J21.4 J22.4 J23.4 J24.4 J26.4 R133.1 U20.2(A1) U20.12(GND) U20.21(A2) U$6.P$5 U$6.P$8 U$10.4(GND)
I2C2_SCL: IC3.69(PB10)
I2C2_SDA: IC3.70(PB11)
MIDBOTTOMWIPER1: R120.2 U1.83(P4[5])
MIDBOTTOMWIPER2: J42.17 U1.79(P0[7])
MIDDLEWIPER1: R115.1 U1.45(P3[1])
MIDDLEWIPER2: J42.18 U1.80(P4[2])
MSPI1_MISO: J11.3 U1.27(P1[6])
MSPI1_MOSI: J11.4 R119.1
MSPI1_NSS: J11.2 R118.1
MSPI1_SCK: J11.1 R117.1
MSPI2_MISO: J12.3 U1.33(P5[6])
MSPI2_MOSI: J12.4 R124.1
MSPI2_NSS: J12.2 R122.1
MSPI2_SCK: J12.1 R121.1
N$1: R6.1 U4.1(A)
N$2: R2.1 U3.1(A)
N$3: IC3.77(PD8) PD8.1
N$4: IC3.78(PD9) PD9.1
N$5: LED2.A R79.2
N$6: IC3.134(PB4(!JTRST!)) R79.1
N$7: R8.1 U5.1(A)
N$8: IC3.4(PE5) R81.2
N$9: J42.1 U1.3(P2[7])
N$10: IC16.6(B:-IN) R167.2 R168.2 R169.1
N$11: JP17.1 X6.19
N$12: JP18.1 X6.20
N$13: IC3.3(PE4) R83.2
N$14: JP13.1 X6.18
N$15: JP12.1 X6.17
N$16: LED3.A R123.2
N$17: IC3.5(PE6) R84.2
N$18: R123.1 U1.17(P5[1])
N$19: IC3.1(PE2) R62.2
N$20: P5_2.1 U1.18(P5[2])
N$21: P5_3.1 U1.19(P5[3])
N$22: C138.1 U2.63(VCCA)
N$23: C170.1 U2.76(P0[4])
N$24: J42.2 U1.2(P2[6])
N$25: J42.3 U1.1(P2[5])
N$26: D2.A J28.1
N$27: IC16.2(A:-IN) R159.1 R160.2 R161.2 R162.2
N$28: IC16.7(B:OUT) R9.1 R169.2
N$29: IC16.9(C:-IN) R177.2 R178.2 R183.1
N$30: C50.1 C53.1 IC5.IN U$3.P$5(12VOUT)
N$31: C60.1 C61.2 R55.1
N$32: C158.+ IC16.1(A:OUT) R159.2
N$33: R16.1 U6.1(A)
N$34: C49.2 C54.2 IC6.IN U$3.P$3(-12VOUT)
N$35: R18.1 U7.1(A)
N$36: R20.1 U8.1(A)
N$37: R22.1 U9.1(A)
N$38: R24.1 U14.1(A)
N$39: R26.1 U10.1(A)
N$40: R28.1 U11.1(A)
N$41: R30.1 U12.1(A)
N$42: R32.1 U13.1(A)
N$43: C27.1 C28.2 R38.1
N$44: IC3.138(BOOT0) R5.1
N$45: C28.1 IC17.10(C:+IN) R39.2
N$46: IC17.8(C:OUT) IC17.9(C:-IN) R38.2 R40.2
N$47: C29.1 IC17.12(D:+IN) R41.1
N$48: C30.1 R40.1 R41.2
N$49: C33.1 C34.2 R45.1
N$50: C34.1 IC1.3(A:+IN) R46.2
N$51: IC1.1(A:OUT) IC1.2(A:-IN) R45.2 R47.2
N$52: C35.1 IC1.5(B:+IN) R48.1
N$53: C36.1 R47.1 R48.2
N$54: C37.1 C38.2 R50.1
N$55: C38.1 IC1.10(C:+IN) R51.2
N$56: IC1.8(C:OUT) IC1.9(C:-IN) R50.2 R52.2
N$57: C39.1 IC1.12(D:+IN) R53.1
N$58: C40.1 R52.1 R53.2
N$59: C61.1 IC7.3(A:+IN) R56.2
N$60: IC7.1(A:OUT) IC7.2(A:-IN) R55.2 R57.2
N$61: LED1.A R104.2
N$62: C62.1 IC7.5(B:+IN) R58.1
N$63: C70.1 R57.1 R58.2
N$64: C71.1 C72.2 R60.1
N$65: C72.1 IC7.10(C:+IN) R61.2
N$66: IC7.8(C:OUT) IC7.9(C:-IN) R60.2 R63.2
N$67: C73.1 IC7.12(D:+IN) R64.1
N$68: C23.1 C24.2 R34.1
N$69: C24.1 IC17.3(A:+IN) R33.2
N$70: C74.1 R63.1 R64.2
N$71: IC17.1(A:OUT) IC17.2(A:-IN) R34.2 R35.2
N$72: C26.1 IC17.5(B:+IN) R36.1
N$73: C25.1 R35.1 R36.2
N$74: C75.1 C76.2 R66.1
N$75: C76.1 IC8.3(A:+IN) R67.2
N$76: IC8.1(A:OUT) IC8.2(A:-IN) R66.2 R68.2
N$77: C77.1 IC8.5(B:+IN) R69.1
N$78: C78.1 R68.1 R69.2
N$79: C79.1 C80.2 R71.1
N$80: C80.1 IC8.10(C:+IN) R72.2
N$81: IC8.8(C:OUT) IC8.9(C:-IN) R71.2 R73.2
N$82: C81.1 IC8.12(D:+IN) R74.1
N$83: C82.1 R73.1 R74.2
N$84: C83.1 C84.2 R76.1
N$85: C84.1 IC9.3(A:+IN) R77.2
N$86: IC9.1(A:OUT) IC9.2(A:-IN) R76.2 R78.2
N$87: C85.1 IC9.5(B:+IN) R80.1
N$88: C86.1 R78.1 R80.2
N$89: C87.1 C88.2 R88.1
N$90: C88.1 IC9.10(C:+IN) R89.2
N$91: IC9.8(C:OUT) IC9.9(C:-IN) R88.2 R90.2
N$92: C89.1 IC9.12(D:+IN) R91.1
N$93: C90.1 R90.1 R91.2
N$94: C91.1 C92.2 R93.1
N$95: C92.1 IC10.3(A:+IN) R94.2
N$96: IC10.1(A:OUT) IC10.2(A:-IN) R93.2 R95.2
N$97: C93.1 IC10.5(B:+IN) R96.1
N$98: C94.1 R95.1 R96.2
N$99: C95.1 C96.2 R98.1
N$100: C96.1 IC10.10(C:+IN) R99.2
N$101: IC10.8(C:OUT) IC10.9(C:-IN) R98.2 R100.2
N$102: C97.1 IC10.12(D:+IN) R101.1
N$103: C98.1 R100.1 R101.2
N$104: C31.2 C32.1 IC4.1(+IN) R43.1 R44.2
N$105: C121.2 C122.2 R15.1 R111.1 U$3.P$2(VIN-) VREGGND.1
N$106: C121.1 C122.1 R14.1 R110.1 U$3.P$1(VIN+) VREGIN.1
N$107: J42.4 U1.99(P2[4])
N$108: J42.5 U1.98(P2[3])
N$109: J42.6 U1.6(P6[4])
N$110: J42.7 U1.7(P6[5])
N$111: C126.1 U1.63(VCCA)
N$112: J42.8 U1.8(P6[6])
N$113: J42.11 U1.97(P2[2])
N$114: J42.9 U1.9(P6[7])
N$115: J42.10 U1.95(P2[0])
N$116: C163.1 U1.46(P3[2])
N$117: IC3.79(PD10) PD10.1
N$118: IC3.86(PD15) PD15.1
N$119: J42.12 U1.96(P2[1])
N$120: R117.2 U1.24(P1[4])
N$121: R118.2 U1.25(P1[5])
N$122: R119.2 U1.28(P1[7])
N$123: J3.1 U19.5(SC0)
N$124: R121.2 U1.31(P5[4])
N$125: R122.2 U1.32(P5[5])
N$126: J3.2 U19.4(SD0)
N$127: R124.2 U1.34(P5[7])
N$128: J4.1 U19.7(SC1)
N$129: J4.2 U19.6(SD1)
N$130: J5.1 U19.9(SC2)
N$131: J5.2 U19.8(SD2)
N$132: J6.1 U19.11(SC3)
N$133: J6.2 U19.10(SD3)
N$134: J7.1 U19.14(SC4)
N$135: J7.2 U19.13(SD4)
N$136: R125.2 U20.1(A0)
N$137: J20.1 U20.5(SC0)
N$138: J20.2 U20.4(SD0)
N$139: J21.1 U20.7(SC1)
N$140: J21.2 U20.6(SD1)
N$141: J22.1 U20.9(SC2)
N$142: J22.2 U20.8(SD2)
N$143: J23.1 U20.11(SC3)
N$144: LED4.A R138.2
N$145: S1.1 X5.1
N$146: J23.2 U20.10(SD3)
N$147: J24.1 U20.14(SC4)
N$148: J24.2 U20.13(SD4)
N$149: U$6.P$4 U$10.3(TX(SDA))
N$150: R150.1 U20.23(SDA) U$10.1(SX(SDA))
N$151: U$6.P$1 U$10.5(TY(SCL))
N$152: R126.1 R132.2 U22.8(DIR)
N$154: J25.2 R131.2 U22.6(SDA)
N$155: J25.1 R127.2 U22.7(SCL)
N$156: C147.1 C159.1 J25.3 R126.2 R127.1 R131.1 U22.1(VDD5V) U22.2(VDD3V3)
N$157: C147.2 C159.2 J25.4 R132.1 U22.4(GND)
N$158: PGO1.1 U22.5(PGO)
N$159: J26.1 U20.16(SC5)
N$160: J26.2 U20.15(SD5)
N$161: HOUT1.1 U22.3(OUT)
N$162: R207.2 U2.43(P15[1])
N$163: R200.2 U2.44(P3[0])
N$164: S2.1 X5.2
N$165: S3.1 X5.3
N$166: R153.1 U$9.5(TY(SCL)) X4.3
N$167: S4.1 X5.4
N$168: R154.1 U$9.2(RX(SDA)) X4.4
N$169: R155.1 U$9.3(TX(SDA)) X4.7
N$170: U$6.P$3 U$10.6(RY(SCL))
N$171: U$6.P$7 U$10.2(RX(SDA))
N$172: R133.2 U$6.P$9(S1) U$6.P$10(S2)
N$173: R151.1 U20.22(SCL) U$10.7(SY(SCL))
N$174: R134.1 U20.3(!RESET)
N$175: R152.1 U$9.6(RY(SCL)) X4.1
N$176: S5.1 X5.5
N$177: IC15.3(VIN) U$6.P$2 U$6.P$6 U$10.8(VCC)
N$178: S6.1 X5.6
N$179: S7.1 X5.7
N$180: S8.1 X5.8
N$181: S9.1 X5.9
N$182: S12.1 X5.10
N$183: S10.1 X5.11
N$184: S11.1 X5.12
N$185: R148.1 U19.16(SC5) U$9.7(SY(SCL))
N$186: LED5.A X5.14
N$187: LED6.A X5.15
N$188: LED7.A X5.16
N$189: LED8.A X5.17
N$190: LED9.A X5.18
N$191: LED10.A X5.19
N$192: LED11.A X5.20
N$193: LED12.A X5.21
N$194: R149.1 U19.15(SD5) U$9.1(SX(SDA))
N$195: LED5.C R128.1
N$196: LED6.C R129.1
N$197: LED7.C R135.1
N$198: LED8.C R136.1
N$199: LED9.C R137.1
N$200: LED10.C R139.1
N$201: LED11.C R140.1
N$202: LED12.C R141.1
N$203: P2.23 R142.1 U19.18(SC6)
N$204: U$1.2-09 X8.1
N$205: U$2.2-09 X8.2
N$206: SW1.A X8.3
N$207: SW1.B X8.4
N$208: SW1.1 X8.5
N$209: U$1.3-09 U$2.3-09 X8.6
N$210: U$1.1-09 U$2.1-09 X8.7
N$211: JP21.3 X5.23
N$212: JP21.4 X5.24
N$213: JP21.1 R143.1 R146.2
N$214: JP21.2 R144.1 R145.2
N$215: R143.2 R145.1 X5.22 X8.8
N$216: P2.24 R147.1 U19.17(SD6)
N$217: P1.1 U2.71(P0[0])
N$218: P1.2 U2.72(P0[1])
N$219: P3.2 U2.73(P0[2])
N$220: P4.2 U2.74(P0[3])
N$221: P1.3 U2.80(P4[2])
N$222: P1.4 U2.81(P4[3])
N$223: P1.5 U2.34(P5[7])
N$224: R158.1 U19.3(!RESET)
N$225: R138.1 U2.33(P5[6])
N$226: P2.1 U2.32(P5[5])
N$227: P2.2 U2.31(P5[4])
N$228: P2.3 U2.28(P1[7])
N$229: P2.4 U2.27(P1[6])
N$230: P2.5 U2.25(P1[5])
N$231: P2.6 U2.24(P1[4])
N$232: P2.7 U2.23(P1[3])
N$233: P2.8 U2.22(P1[2])
N$234: P2.21 U2.51(P3[6])
N$235: P2.20 U2.52(P3[7])
N$236: P2.19 U2.53(P12[0])
N$237: P2.18 U2.54(P12[1])
N$238: P2.9 U2.99(P2[4])
N$239: P2.10 U2.98(P2[3])
N$240: P2.11 U2.97(P2[2])
N$241: P2.12 U2.96(P2[1])
N$242: P2.14 U2.67(P12[2])
N$243: P2.15 U2.68(P12[3])
N$244: P2.16 U2.69(P4[0])
N$245: P2.17 U2.70(P4[1])
N$246: IC16.8(C:OUT) R13.1 R183.2
N$247: J38.1 R186.2 U$5.5(SCL)
N$248: J38.2 R191.2 U$5.4(SDA)
N$249: C158.- R10.1
N$250: C174.+ C175.1 C178.1 C179.1 IC2.5(V+) J38.3 R186.1 R191.1 R194.2 U$5.1(VDD)
N$251: IC16.14(D:OUT) R176.2 R184.1
N$252: IC16.13(D:-IN) R170.2 R175.2 R176.1
N$253: R163.1 R166.2 U23.8(DIR)
N$254: J9.2 R165.2 U23.6(SDA)
N$255: J9.1 R164.2 U23.7(SCL)
N$256: C172.1 C173.1 J9.3 R163.2 R164.1 R165.1 U23.1(VDD5V) U23.2(VDD3V3)
N$257: C172.2 C173.2 J9.4 R166.1 U23.4(GND)
N$258: PGO3.1 U23.5(PGO)
N$259: HOUT3.1 U23.3(OUT)
N$261: IC2.3(-IN) R192.2 R193.2
N$262: IC2.4(OUT) J32.RING J32.TIP-NORM R193.1
N$263: J1.SLEEVE(EARTH) J34.3 J34.4 JP20.2
N$264: J1.TIP J34.1 J34.2 JP20.1
N$265: J36.1 J36.2 JP14.1 R10.2 R11.2
N$266: C174.- C175.2 C178.2 C179.2 IC2.2(V-) J32.SLEEVE(EARTH) J38.4 R192.1 R199.1 U$5.2(VSS)
N$267: J32.TIP U$5.3(AIN)
N$268: IC2.1(+IN) R194.1 R199.2
N$269: R171.1 R174.2 U25.8(DIR)
N$270: J27.2 R173.2 U25.6(SDA)
N$271: J27.1 R172.2 U25.7(SCL)
N$272: C176.1 C177.1 J27.3 R171.2 R172.1 R173.1 U25.1(VDD5V) U25.2(VDD3V3)
N$273: C176.2 C177.2 J27.4 R174.1 U25.4(GND)
N$274: PGO5.1 U25.5(PGO)
N$275: HOUT5.1 U25.3(OUT)
N$277: R201.2 U2.45(P3[1])
N$278: IC3.112(PC11) R202.2
N$279: IC3.114(PD0) PD0.1
N$280: IC3.115(PD1) PD1.1
N$281: P64.1 U2.6(P6[4])
N$282: P65.1 U2.7(P6[5])
N$283: P66.1 U2.8(P6[6])
N$284: R209.2 X7.15
N$285: R179.1 R182.2 U27.8(DIR)
N$286: J29.2 R181.2 U27.6(SDA)
N$287: J29.1 R180.2 U27.7(SCL)
N$288: C180.1 C181.1 J29.3 R179.2 R180.1 R181.1 U27.1(VDD5V) U27.2(VDD3V3)
N$289: C180.2 C181.2 J29.4 R182.1 U27.4(GND)
N$290: PGO7.1 U27.5(PGO)
N$291: HOUT7.1 U27.3(OUT)
N$293: R208.2 X7.11
N$294: R112.2 X7.7
N$301: R187.1 R190.2 U29.8(DIR)
N$302: J31.2 R189.2 U29.6(SDA)
N$303: J31.1 R188.2 U29.7(SCL)
N$304: C184.1 C185.1 J31.3 R187.2 R188.1 R189.1 U29.1(VDD5V) U29.2(VDD3V3)
N$305: C184.2 C185.2 J31.4 R190.1 U29.4(GND)
N$306: PGO9.1 U29.5(PGO)
N$307: HOUT9.1 U29.3(OUT)
N$317: R195.1 R198.2 U31.8(DIR)
N$318: J33.2 R197.2 U31.6(SDA)
N$319: J33.1 R196.2 U31.7(SCL)
N$320: C188.1 C189.1 J33.3 R195.2 R196.1 R197.1 U31.1(VDD5V) U31.2(VDD3V3)
N$321: C188.2 C189.2 J33.4 R198.1 U31.4(GND)
N$322: PGO11.1 U31.5(PGO)
N$323: HOUT11.1 U31.3(OUT)
N$333: R203.1 R206.2 U33.8(DIR)
N$334: J35.2 R205.2 U33.6(SDA)
N$335: J35.1 R204.2 U33.7(SCL)
N$336: C192.1 C193.1 J35.3 R203.2 R204.1 R205.1 U33.1(VDD5V) U33.2(VDD3V3)
N$337: C192.2 C193.2 J35.4 R206.1 U33.4(GND)
N$338: PGO13.1 U33.5(PGO)
N$339: HOUT13.1 U33.3(OUT)
N$349: R211.1 R214.2 U35.8(DIR)
N$350: J37.2 R213.2 U35.6(SDA)
N$351: J37.1 R212.2 U35.7(SCL)
N$352: C196.1 C197.1 J37.3 R211.2 R212.1 R213.1 U35.1(VDD5V) U35.2(VDD3V3)
N$353: C196.2 C197.2 J37.4 R214.1 U35.4(GND)
N$354: PGO15.1 U35.5(PGO)
N$355: HOUT15.1 U35.3(OUT)
N$365: R219.1 R222.2 U37.8(DIR)
N$366: J39.2 R221.2 U37.6(SDA)
N$367: J39.1 R220.2 U37.7(SCL)
N$368: C200.1 C201.1 J39.3 R219.2 R220.1 R221.1 U37.1(VDD5V) U37.2(VDD3V3)
N$369: C200.2 C201.2 J39.4 R222.1 U37.4(GND)
N$370: PGO17.1 U37.5(PGO)
N$371: HOUT17.1 U37.3(OUT)
N$381: R227.1 R230.2 U39.8(DIR)
N$382: J41.2 R229.2 U39.6(SDA)
N$383: J41.1 R228.2 U39.7(SCL)
N$384: C204.1 C205.1 J41.3 R227.2 R228.1 R229.1 U39.1(VDD5V) U39.2(VDD3V3)
N$385: C204.2 C205.2 J41.4 R230.1 U39.4(GND)
N$386: PGO19.1 U39.5(PGO)
N$387: HOUT19.1 U39.3(OUT)
OPT1: R1.1 U3.3(C) X10.1
OPT1_A: C23.2 OPT1_A.1 X11.1
OPT1_B: C25.2 IC17.6(B:-IN) IC17.7(B:OUT) OPT1_B.1 R37.2
OPT2: R3.1 U4.3(C) X10.2
OPT2_A: C27.2 OPT2_A.1 X11.2
OPT2_B: C30.2 IC17.13(D:-IN) IC17.14(D:OUT) OPT2_B.1 R42.2
OPT3: R7.1 U5.3(C) X10.3
OPT3_A: C33.2 OPT3_A.1 X11.3
OPT3_B: C36.2 IC1.6(B:-IN) IC1.7(B:OUT) OPT3_B.1 R49.2
OPT4: R12.1 U6.3(C) X10.4
OPT4_A: C37.2 OPT4_A.1 X11.4
OPT4_B: C40.2 IC1.13(D:-IN) IC1.14(D:OUT) OPT4_B.1 R54.2
OPT5: R17.1 U7.3(C) X10.5
OPT5_A: C60.2 OPT5_A.1 X11.5
OPT5_B: C70.2 IC7.6(B:-IN) IC7.7(B:OUT) OPT5_B.1 R59.2
OPT6: R19.1 U8.3(C) X10.6
OPT6_A: C71.2 OPT6_A.1 X11.6
OPT6_B: C74.2 IC7.13(D:-IN) IC7.14(D:OUT) OPT6_B.1 R65.2
OPT7: R21.1 U9.3(C) X10.7
OPT7_A: C75.2 OPT7_A.1 X11.7
OPT7_B: C78.2 IC8.6(B:-IN) IC8.7(B:OUT) OPT7_B.1 R70.2
OPT8: R25.1 U10.3(C) X10.8
OPT8_A: C79.2 OPT8_A.1 X11.8
OPT8_B: C82.2 IC8.13(D:-IN) IC8.14(D:OUT) OPT8_B.1 R75.2
OPT9: R27.1 U11.3(C) X10.9
OPT9_A: C83.2 OPT9_A.1 X11.9
OPT9_B: C86.2 IC9.6(B:-IN) IC9.7(B:OUT) OPT9_B.1 R85.2
OPT10: R29.1 U12.3(C) X10.10
OPT10_A: C87.2 OPT10_A.1 X11.10
OPT10_B: C90.2 IC9.13(D:-IN) IC9.14(D:OUT) OPT10_B.1 R92.2
OPT11: R31.1 U13.3(C) X10.11
OPT11_A: C91.2 OPT11_A.1 X11.11
OPT11_B: C94.2 IC10.6(B:-IN) IC10.7(B:OUT) OPT11_B.1 R97.2
OPT12: R23.1 U14.3(C) X10.12
OPT12_A: C95.2 OPT12_A.1 X11.12
OPT12_B: C98.2 IC10.13(D:-IN) IC10.14(D:OUT) OPT12_B.1 R102.2
OPT_PWR: C21.1 C22.1 C123.1 R1.2 R3.2 R7.2 R12.2 R17.2 R19.2 R21.2 R23.2 R25.2 R27.2 R29.2 R31.2 U16.5(IN) X10.14
OPT_PWR_EN: U16.4(EN) X10.16
OPT_PWR_EN_A: IC3.55(PF15) X11.16
OPT_PWR_SW: C15.1 C16.1 C182.1 OPT_PWR.1 R2.2 R6.2 R8.2 R16.2 R18.2 R20.2 R22.2 R24.2 R26.2 R28.2 R30.2 R32.2 U16.1(OUT)
OSC1: C17.1 IC3.23(PH0/OSC_IN) Q1.1(X1)
OSC2: C18.1 IC3.24(PH1/OSC_OUT) Q1.3(X2)
PA0: IC3.34(PA0) PA0.1 R37.1
PA1: IC3.35(PA1) PA1.1 R42.1
PA2: IC3.36(PA2) PA2.1 R49.1
PA3: IC3.37(PA3) PA3.1 R54.1
PA4: IC3.40(PA4) PA4.1 R59.1
PA5: IC3.41(PA5) PA5.1 R65.1
PA6: IC3.42(PA6) PA6.1 R70.1
PA7: IC3.43(PA7) PA7.1 R75.1
PA8: IC3.100(PA8)
PA9: IC3.101(PA9)
PA10: IC3.102(PA10)
PA11: IC3.103(PA11)
PA12: IC3.104(PA12)
PB0: IC3.46(PB0) PB0.1 R97.1
PB1: IC3.47(PB1) PB1.1 R102.1
PB5: IC3.135(PB5)
PB6: IC3.136(PB6)
PB7: IC3.137(PB7)
PB8: IC3.139(PB8)
PB9: IC3.140(PB9)
PB12: IC3.73(PB12) J10.2
PB13: IC3.74(PB13) J10.1
PB14: IC3.75(PB14) J10.3
PB15: IC3.76(PB15) J10.4
PC4: IC3.44(PC4) PC4.1 R85.1
PC5: IC3.45(PC5) PC5.1 R92.1
PC6: IC3.96(PC6)
PC7: IC3.97(PC7)
PC14: IC3.8(PC14/OSC32_IN)
PC15: IC3.9(PC15/OSC32_OUT)
PD3: IC3.117(PD3)
PD4: IC3.118(PD4)
PD7: IC3.123(PD7) R107.2
PD11: IC3.80(PD11) R82.2 R86.2 R87.2 R108.2
PD12: IC3.81(PD12)
PD13: IC3.82(PD13)
PF6: IC3.18(PF6)
PF7: IC3.19(PF7)
PF8: IC3.20(PF8)
PF9: IC3.21(PF9)
PF10: IC3.22(PF10)
PG6: IC3.91(PG6)
PG7: IC3.92(PG7)
PG9: IC3.124(PG9) R109.1
PG10: IC3.125(PG10) R106.1
PG11: IC3.126(PG11) R105.1
PG12: IC3.127(PG12)
SAI1_FS_A: R82.1 R83.1
SAI1_MCLK_A: R62.1 R87.1
SAI1_SCK_A: R81.1 R86.1
SAI1_SD_A: R84.1 R108.1
SAI1_SD_B: IC3.2(PE3)
SCL_B: U2.56(P15[3]) U19.22(SCL)
SDA_B: U2.55(P15[2]) U19.23(SDA)
SPI1_CS: JP9.17 JP10.17 JP11.17 X7.9
SPI1_CS_B: J15.2 R201.1 X9.9
SPI1_MISO: JP9.19 JP10.19 JP11.19 R208.1
SPI1_MISO_B: J15.3 U2.42(P15[0]) X9.11
SPI1_MISO_OUT: J8.3 R109.2
SPI1_MOSI: JP9.20 JP10.20 JP11.20 X7.12
SPI1_MOSI_B: J15.4 R207.1 X9.12
SPI1_MOSI_OUT: J8.4 R107.1
SPI1_NSS_OUT: J8.2 R106.2
SPI1_SCK: JP9.18 JP10.18 JP11.18 X7.10
SPI1_SCK_OUT: J8.1 R105.2
SPI1_SCLK_B: J15.1 R200.1 X9.10
SPI2_CS: JP6.3 JP7.3 JP8.3 X7.13
SPI2_CS_B: J14.2 U2.49(P3[5]) X9.13
SPI2_MISO: JP6.5 JP7.5 JP8.5 R209.1
SPI2_MISO_B: J14.3 U2.46(P3[2]) X9.15
SPI2_MOSI: JP6.6 JP7.6 JP8.6 X7.16
SPI2_MOSI_B: J14.4 U2.47(P3[3]) X9.16
SPI2_SCK: JP6.4 JP7.4 JP8.4 X7.14
SPI2_SCLK_B: J14.1 U2.48(P3[4]) X9.14
SPI3_BOOTLOAD_MISO: J2.3 R202.1
SPI3_BOOTLOAD_MOSI: IC3.113(PC12) J2.4
SPI3_BOOTLOAD_NSS: IC3.110(PA15(JTDI)) J2.2
SPI3_BOOTLOAD_SCK: IC3.111(PC10) J2.1
SPI3_CS_B: J13.2 U2.19(P5[3]) X9.5
SPI3_MISO_B: J13.3 U2.16(P5[0]) X9.7
SPI3_MOSI_B: J13.4 U2.17(P5[1]) X9.8
SPI3_SCLK_B: J13.1 U2.18(P5[2]) X9.6
SPI5_CS: JP9.9 JP10.9 JP11.9 X7.5
SPI5_MISO: JP9.7 JP10.7 JP11.7 R112.1
SPI5_MOSI: JP9.8 JP10.8 JP11.8 X7.8
SPI5_SCK: JP9.10 JP10.10 JP11.10 X7.6
SWCLK: IC3.109(PA14(JTCK/SWCLK)) X2.4
SWD_CK_2: U1.21(P1[1]) X3.4
SWD_CK_3: U2.21(P1[1]) X1.4
SWD_IO_2: U1.20(P1[0]) X3.2
SWD_IO_3: U2.20(P1[0]) X1.2
SWDIO: IC3.105(PA13(JTMS-SWDIO)) X2.2
SWDRESET: C5.1 IC3.25(!RST) X2.10
SWO: IC3.133(PB3(JTDO/TRACESWO)) X2.6
TOPWIPER1: R113.1 U1.74(P0[3])
TOPWIPER2: J42.19 U1.73(P0[2])
TOUCH1: X6.1
TOUCH2: X6.2
TOUCH3: X6.3
TOUCH4: X6.4
TOUCH5: X6.5
TOUCH6: X6.6
TOUCH7: X6.7
TOUCH8: X6.8
TOUCH9: X6.9
TOUCH10: X6.10
TOUCH11: X6.11
TOUCH12: X6.12
USB_VBUS: R156.1 R157.2 U2.77(P0[5])
VBUS: JP19.7 R156.2
VCAP1: C19.1 IC3.71(VCAP) IC3.106(VCAP)
VCCD0_2: C131.1 C132.1 U1.39(VCCD0) U1.86(VCCD1)
VCCD0_3: C139.1 C140.1 U2.39(VCCD0) U2.86(VCCD1)
VOUT1: R113.2 U1.71(P0[0])
VOUT2: R114.2 U1.72(P0[1])
VOUT3: R115.2 U1.51(P3[6])
VOUT4: R120.1 U1.52(P3[7])
VREF: C64.1 IC3.32(VREF+) R4.2
XRES_2: U1.15(!XRES) X3.10
XRES_3: U2.15(!XRES) X1.10
Unconnected: IC3.7(PC13) IC3.10(PF0) IC3.11(PF1) IC3.12(PF2) IC3.13(PF3) IC3.14(PF4) IC3.15(PF5) IC3.26(PC0) IC3.27(PC1) IC3.28(PC2_C) IC3.29(PC3_C) IC3.48(PB2) IC3.49(PF11) IC3.50(PF12) IC3.53(PF13) IC3.54(PF14) IC3.58(PE7) IC3.59(PE8) IC3.60(PE9) IC3.63(PE10) IC3.64(PE11) IC3.65(PE12) IC3.66(PE13) IC3.67(PE14) IC3.68(PE15) IC3.85(PD14) IC3.88(PG3) IC3.89(PG4) IC3.90(PG5) IC3.93(PG8) IC3.98(PC8) IC3.99(PC9) IC3.116(PD2) IC3.119(PD5) IC3.122(PD6) IC3.128(PG13) IC3.129(PG14) IC3.132(PG15) IC3.141(PE0) IC3.142(PE1) IC11.3(PG) J1.RING J1.RING-NORM J1.SLEEVE-NORM(EARTH-NORM) J1.TIP-NORM J28.3 J32.RING-NORM J32.SLEEVE-NORM(EARTH-NORM) JP3.1 JP3.7 JP4.1 JP4.7 JP5.1 JP5.7 JP6.1 JP6.2 JP6.7 JP6.8 JP6.9 JP6.10 JP6.11 JP6.12 JP6.13 JP6.14 JP6.15 JP6.16 JP6.17 JP6.18 JP7.1 JP7.2 JP7.7 JP7.8 JP7.9 JP7.10 JP7.11 JP7.12 JP7.13 JP7.14 JP7.15 JP7.16 JP7.17 JP7.18 JP8.1 JP8.2 JP8.7 JP8.8 JP8.9 JP8.10 JP8.11 JP8.12 JP8.13 JP8.14 JP8.15 JP8.16 JP8.17 JP8.18 JP9.1 JP9.2 JP9.3 JP9.4 JP9.5 JP9.6 JP9.11 JP9.12 JP9.13 JP9.14 JP9.15 JP9.16 JP9.21 JP9.23 JP9.25 JP9.26 JP9.27 JP9.28 JP9.29 JP9.30 JP10.1 JP10.2 JP10.3 JP10.4 JP10.5 JP10.6 JP10.11 JP10.12 JP10.13 JP10.14 JP10.15 JP10.16 JP10.21 JP10.22 JP10.23 JP10.25 JP10.26 JP10.27 JP10.28 JP10.29 JP10.30 JP11.1 JP11.2 JP11.3 JP11.4 JP11.5 JP11.6 JP11.11 JP11.12 JP11.13 JP11.14 JP11.15 JP11.16 JP11.21 JP11.23 JP11.24 JP11.25 JP11.26 JP11.27 JP11.28 JP11.29 JP11.30 JP19.1 JP19.2 JP19.5 JP19.6 U1.4(P12[4]) U1.5(P12[5]) U1.11(IND) U1.16(P5[0]) U1.22(P1[2]) U1.23(P1[3]) U1.29(P12[6]) U1.30(P12[7]) U1.35(P15[6]) U1.36(P15[7]) U1.42(P15[0]) U1.43(P15[1]) U1.44(P3[0]) U1.47(P3[3]) U1.48(P3[4]) U1.49(P3[5]) U1.53(P12[0]) U1.54(P12[1]) U1.55(P15[2]) U1.56(P15[3]) U1.67(P12[2]) U1.68(P12[3]) U1.69(P4[0]) U1.70(P4[1]) U1.76(P0[4]) U1.81(P4[3]) U1.82(P4[4]) U1.84(P4[6]) U1.85(P4[7]) U1.89(P6[0]) U1.90(P6[1]) U1.91(P6[2]) U1.92(P6[3]) U1.94(P15[5]) U2.1(P2[5]) U2.2(P2[6]) U2.3(P2[7]) U2.4(P12[4]) U2.5(P12[5]) U2.9(P6[7]) U2.11(IND) U2.29(P12[6]) U2.30(P12[7]) U2.78(P0[6]) U2.79(P0[7]) U2.82(P4[4]) U2.83(P4[5]) U2.84(P4[6]) U2.85(P4[7]) U2.89(P6[0]) U2.90(P6[1]) U2.91(P6[2]) U2.92(P6[3]) U2.93(P15[4]) U2.94(P15[5]) U2.95(P2[0]) U16.3(!OC!) U19.19(SD7) U19.20(SC7) U20.17(SD6) U20.18(SC6) U20.19(SD7) U20.20(SC7) X1.6 X1.8 X2.8 X3.6 X3.8

## Notes on the sheet
- DW-05-08-L-D-215  and ESW-105-12-L-D for 10 pin
- DW-12-08-L-D-215 and ESW-112-12-L-D for 24 pin | adafruit 4090 usb-c connector
- pwr
- VR20S05
- lmv611
- LVM614
- lnj426W83RA - 10ma
- 0.05" SWD 10-pin
- don't actually need high current here | actually 15v / -15v out
- vr20s05
- produce linear +-12v for opamp
- need wider rails here - opa1654 is good and only $2.83
- vr20s05
- pc5 | pc5 | pc5
- pb1 | pb1 | pb1
- 10 = 2
- 0 0 = 0 | 01 = 1